# EasyEDA Pro project Drone.eprj, schematic Schematic1, sheets 5 to 9 of 9

## Sheets
5 Filitering Caps: Create Date: 2025-06-17; Page Name: Filitering Caps; Update Date: 2025-09-04
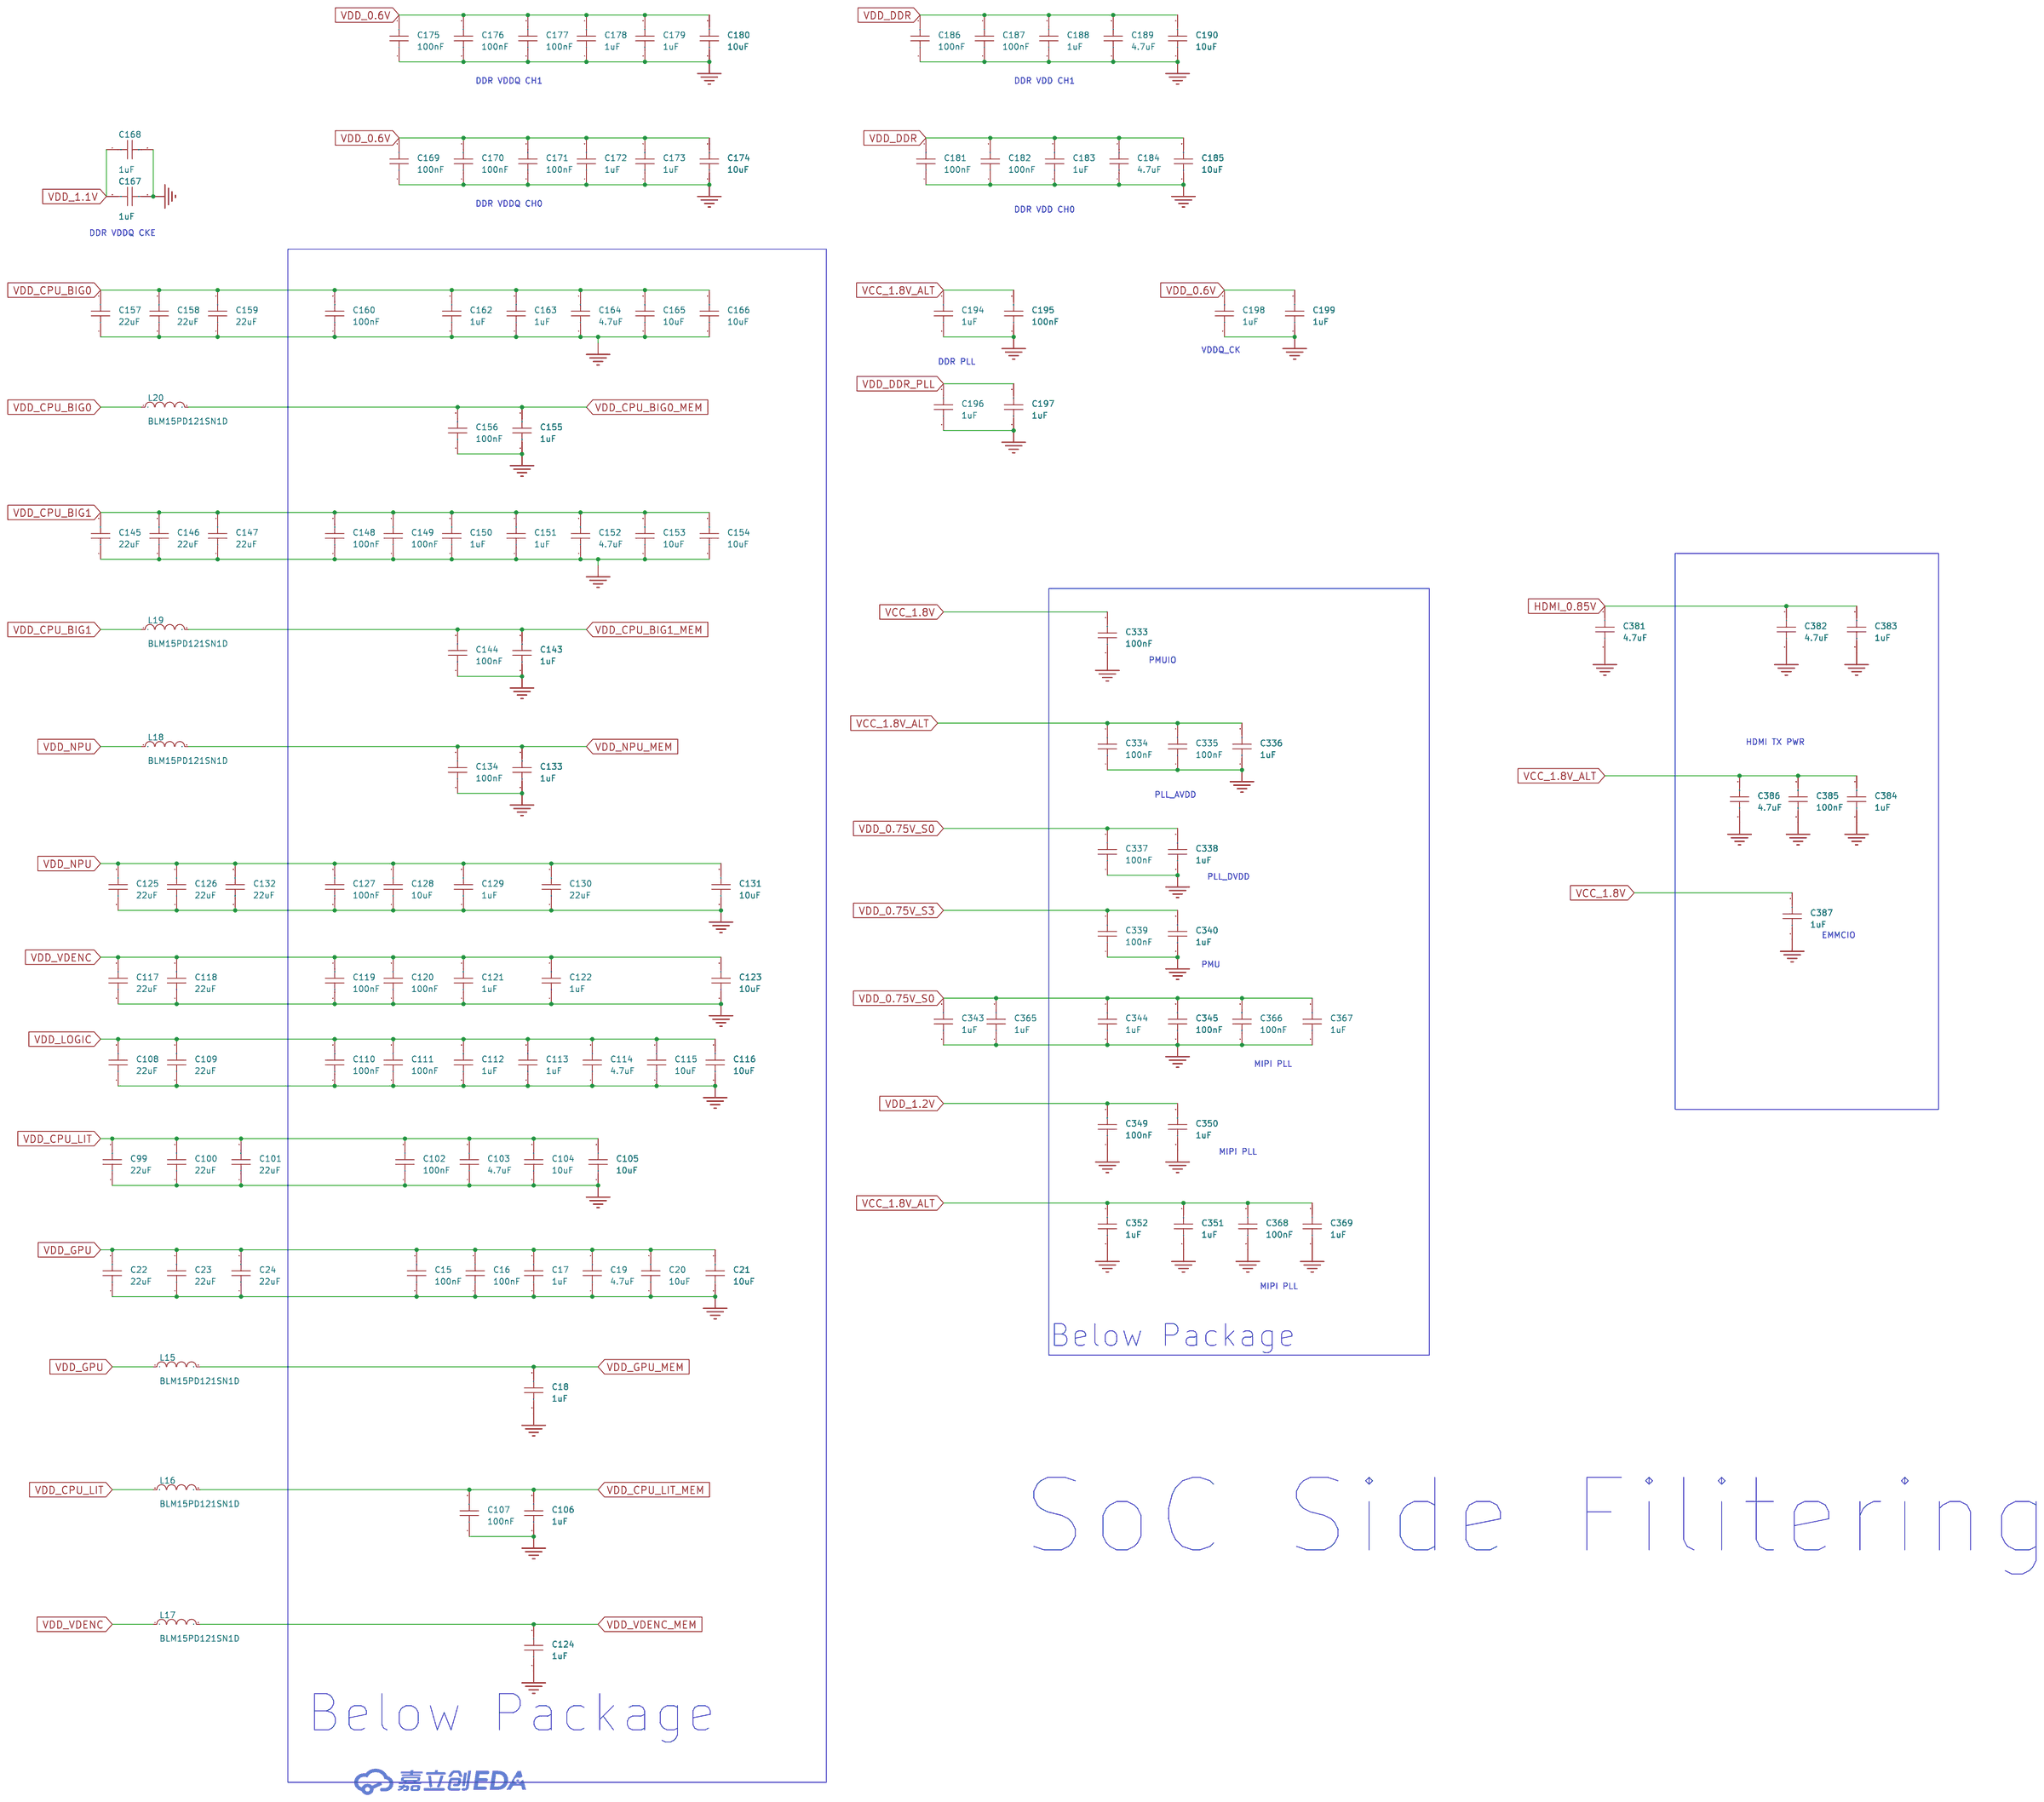
[diagram p4: Filitering Caps]
6 Wireless: Create Date: 2025-06-18; Page Name: Wireless; Update Date: 2025-08-09
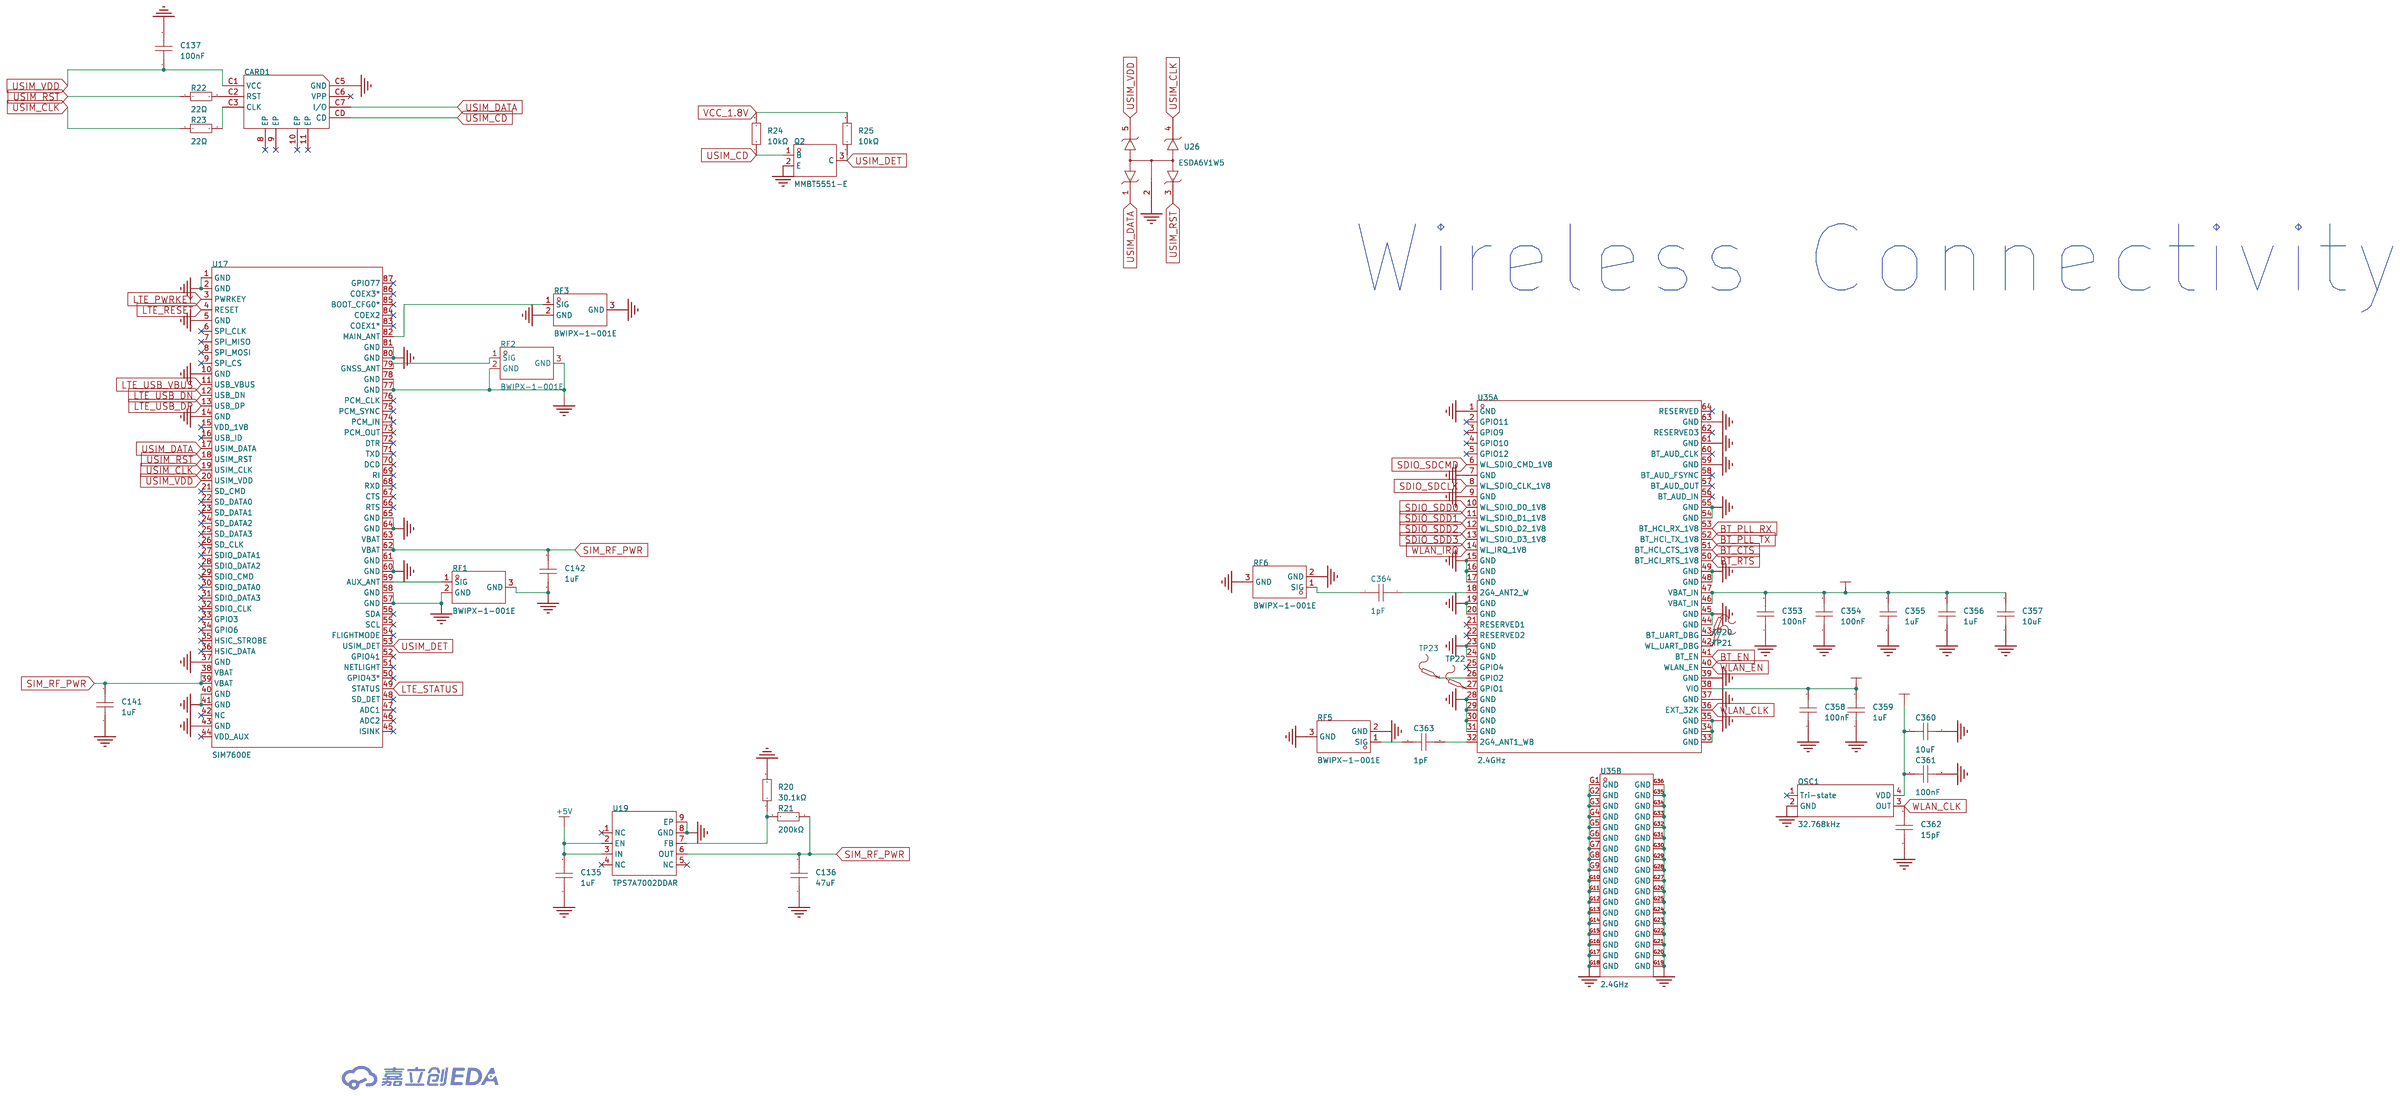
[diagram p5: Wireless]
7 Audio: Create Date: 2025-06-23; Page Name: P7; Update Date: 2025-06-30
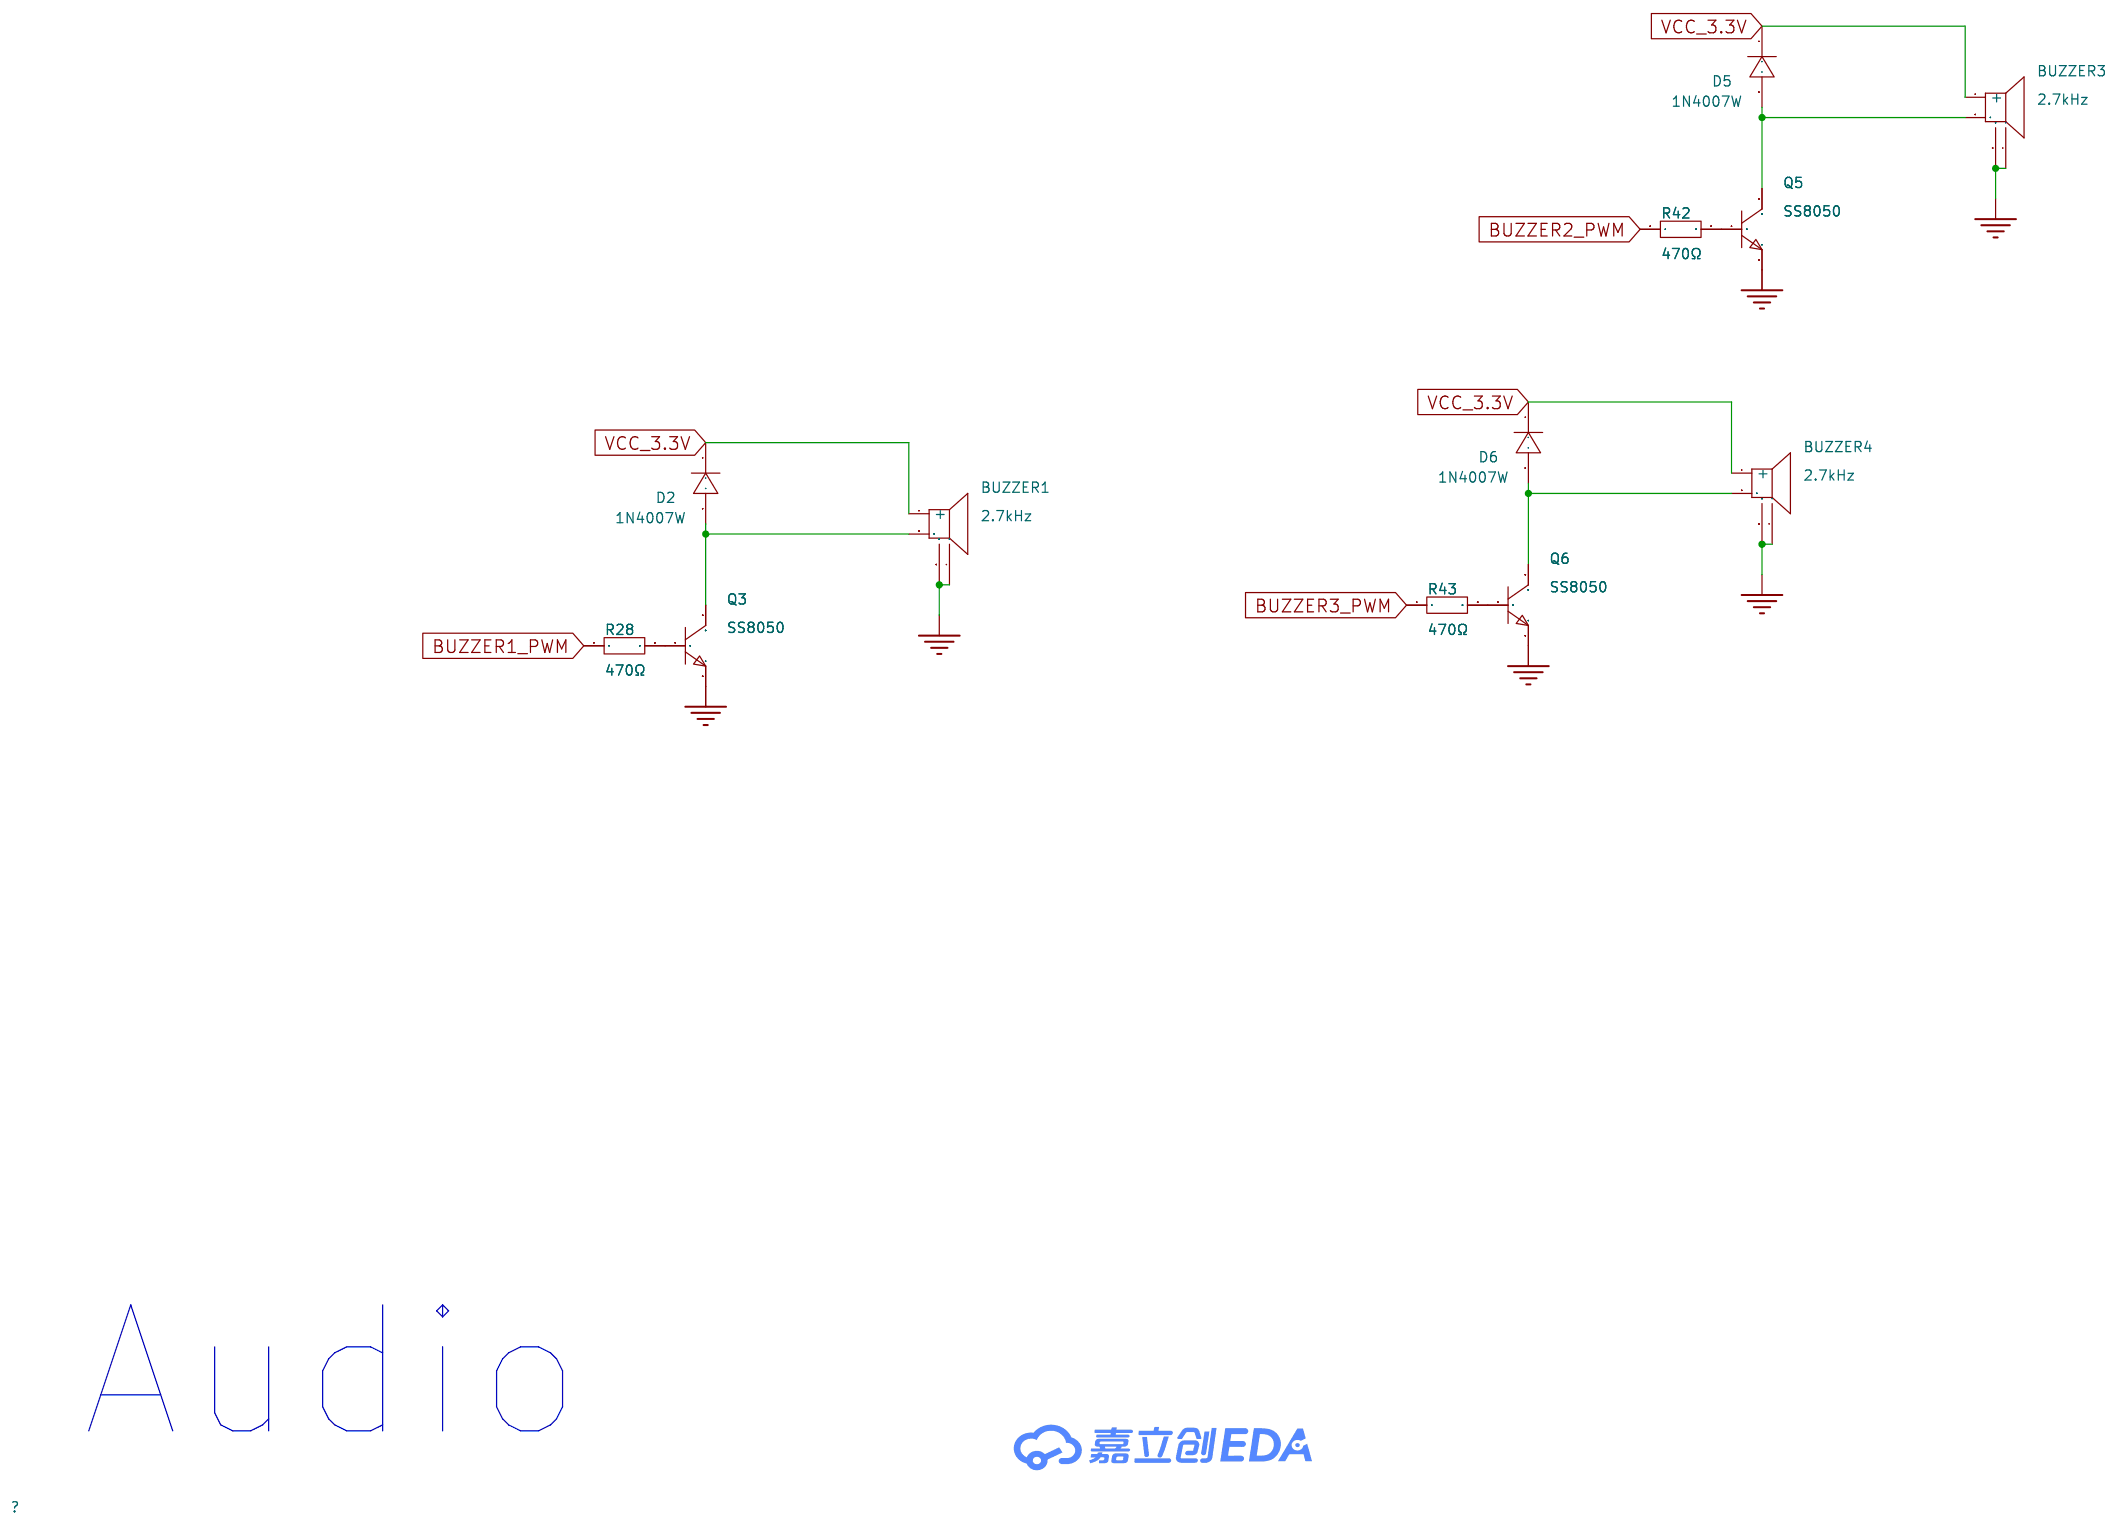
[diagram p6: Audio]
8 PLL Interface: Create Date: 2025-08-03; Page Name: PLL Interface; Update Date: 2025-08-07
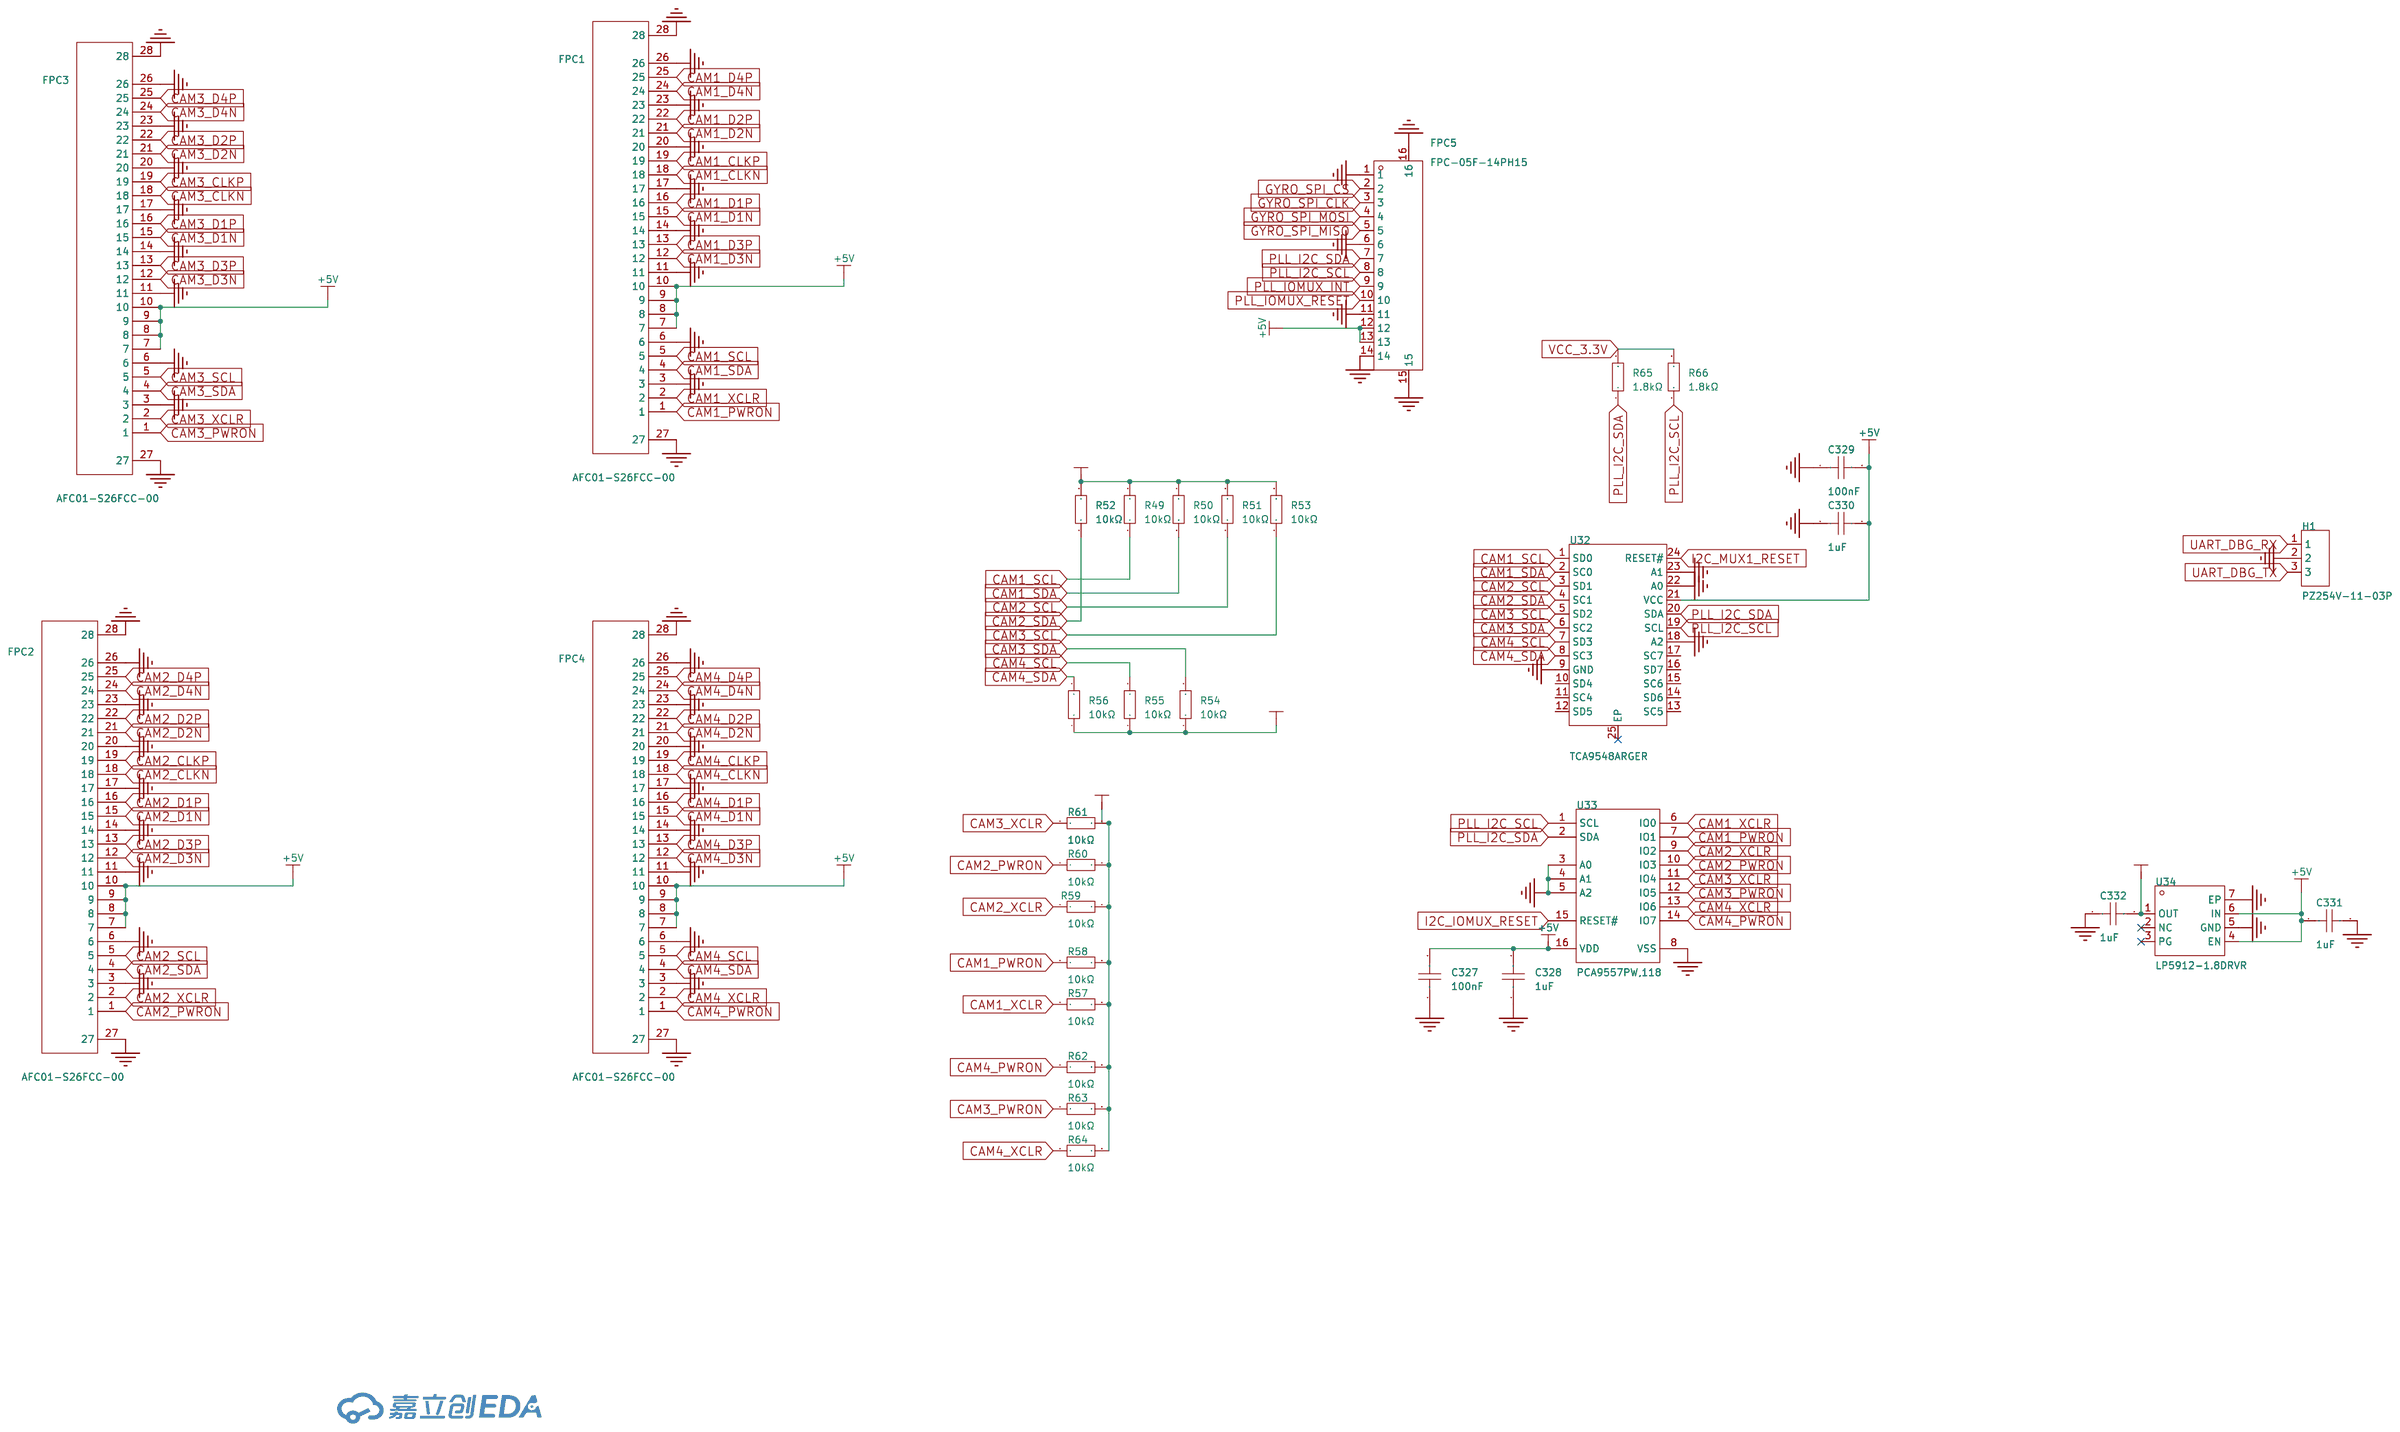
[diagram p7: PLL Interface]
9 HDMI and USB: Create Date: 2025-08-09; Page Name: HDMI and USB; Update Date: 2025-08-22
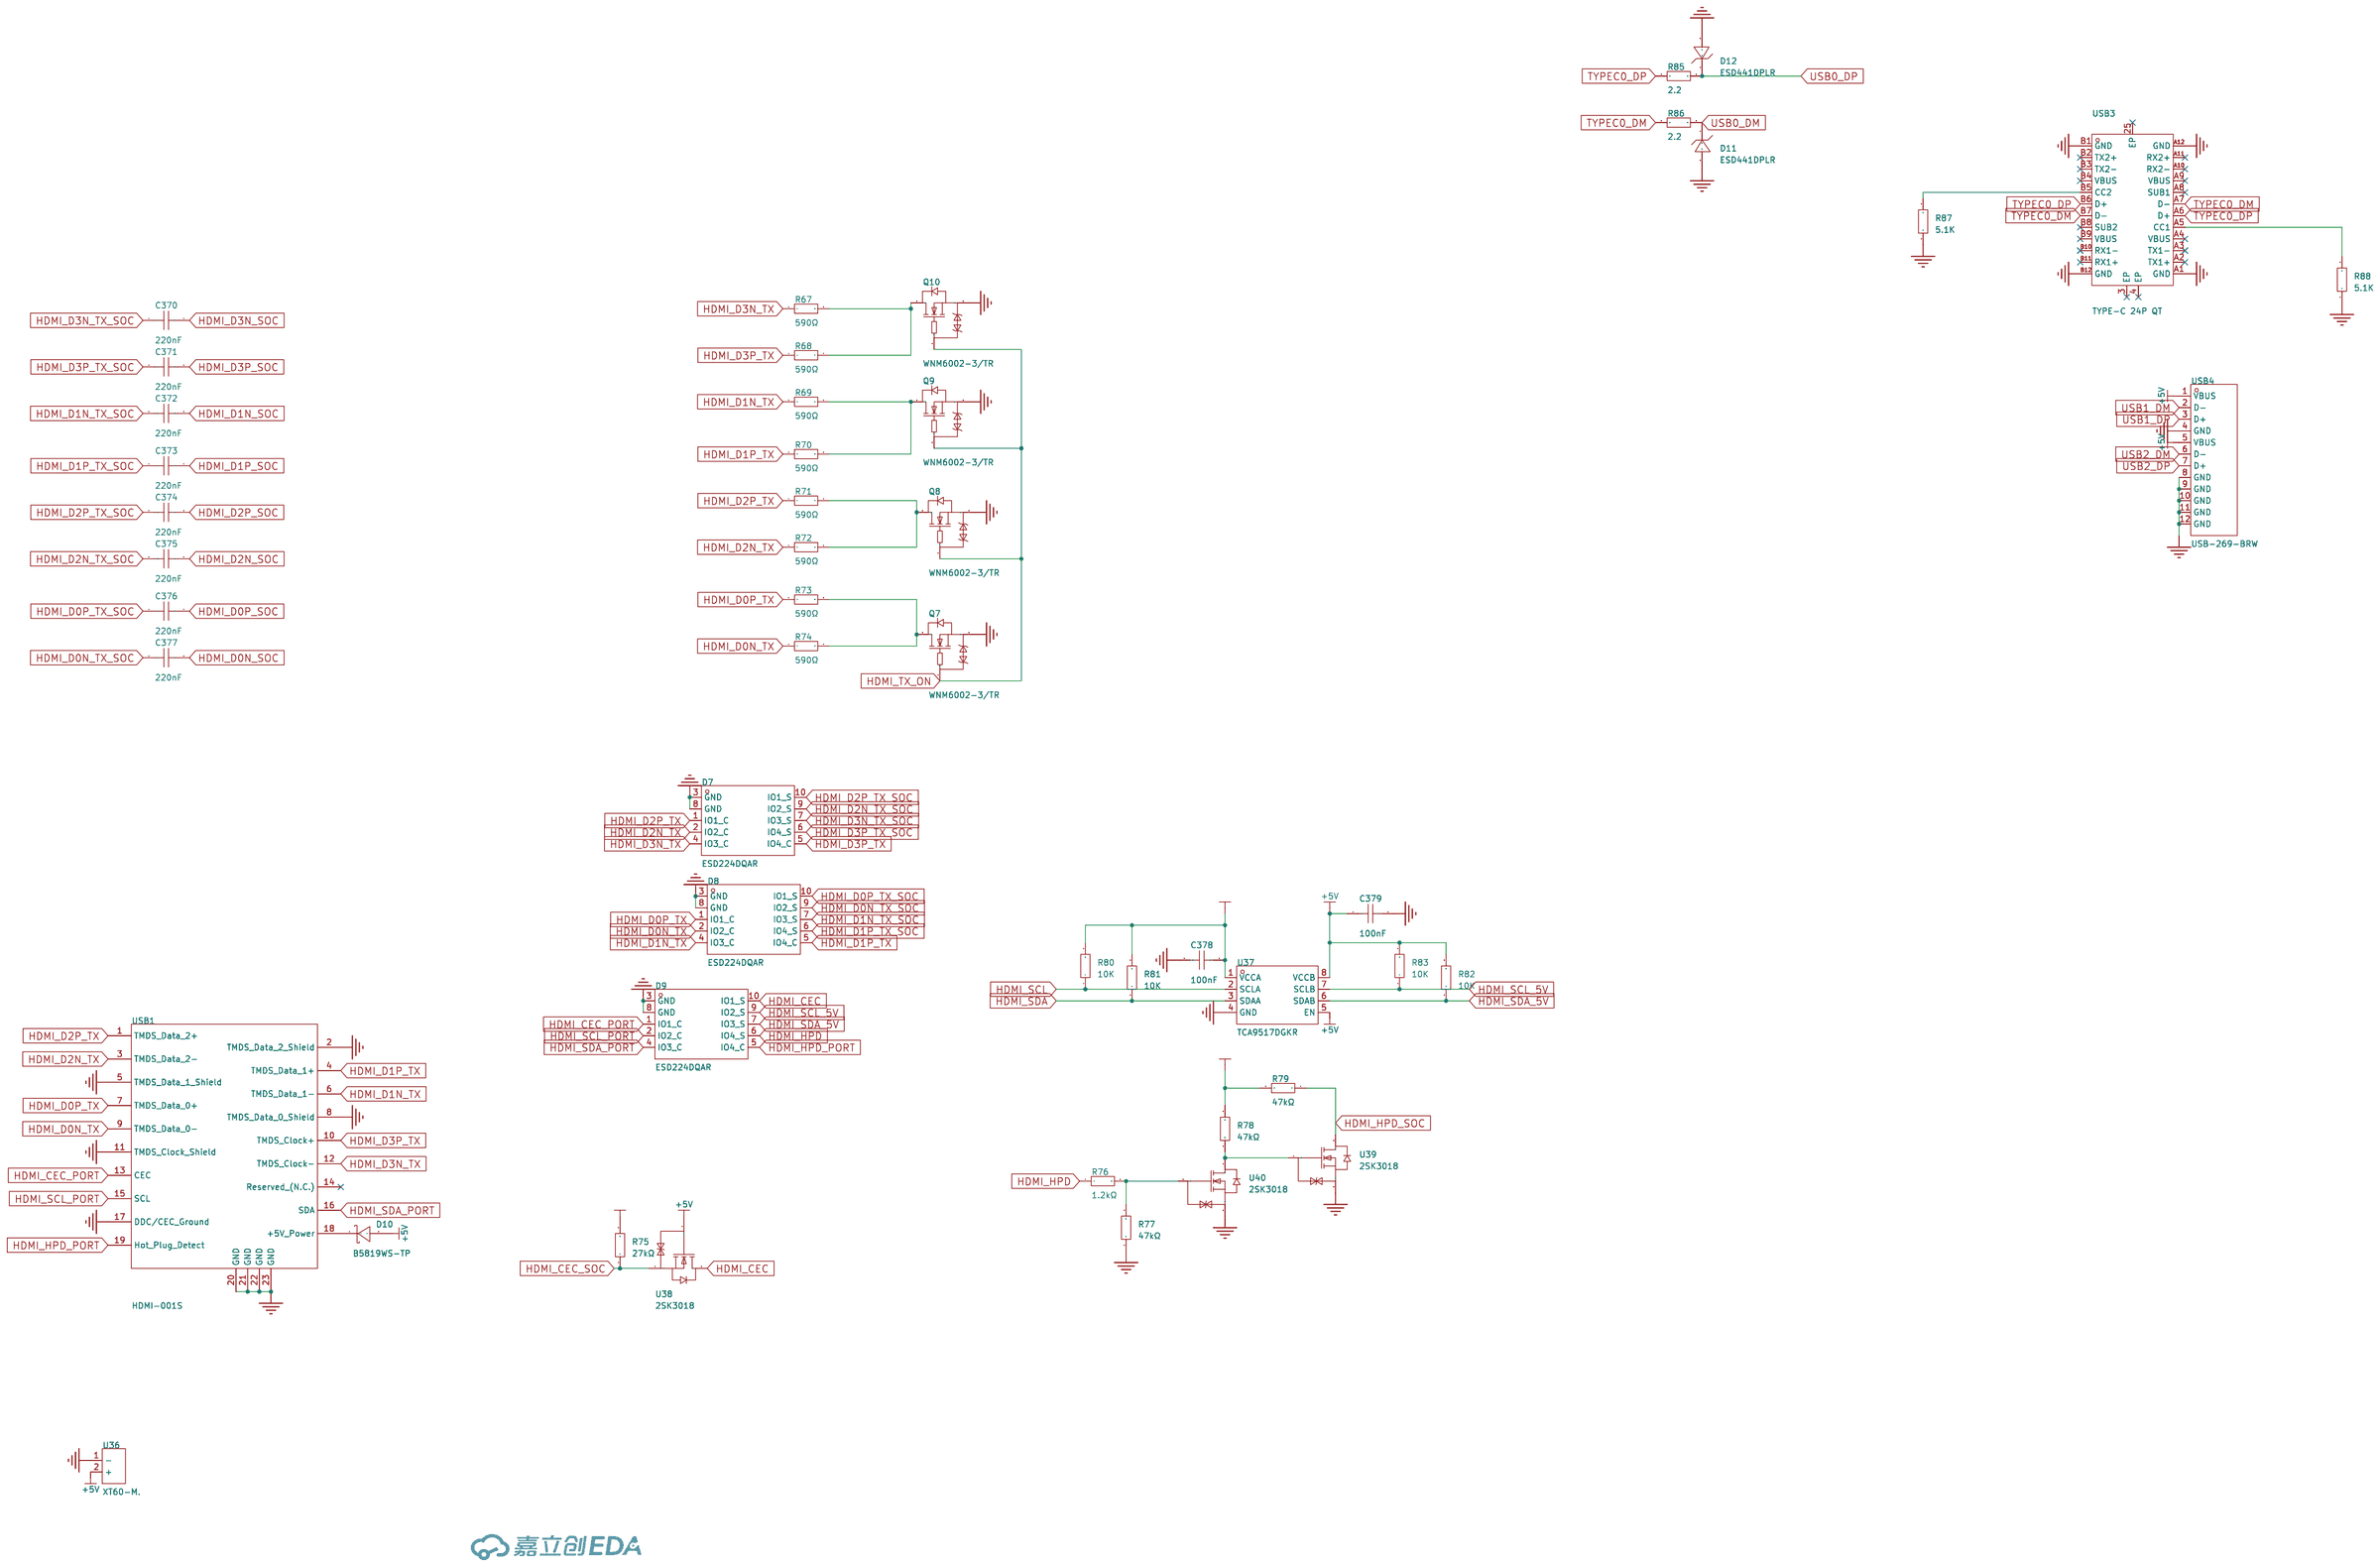
[diagram p8: HDMI and USB]

## Parts
sheet Audio
BUZZER1  2.7kHz  [BUZ-SMD_4P-L8.5-W8.5-P8.50-BR]
BUZZER3  2.7kHz  [BUZ-SMD_4P-L8.5-W8.5-P8.50-BR]
BUZZER4  2.7kHz  [BUZ-SMD_4P-L8.5-W8.5-P8.50-BR]
D2  1N4007W  [SOD-123FL_L2.7-W1.8-LS3.8-RD]
D5  1N4007W  [SOD-123FL_L2.7-W1.8-LS3.8-RD]
D6  1N4007W  [SOD-123FL_L2.7-W1.8-LS3.8-RD]
Q3  SS8050  [SOT-23-3_L2.9-W1.3-P1.90-LS2.4-BR]
Q5  SS8050  [SOT-23-3_L2.9-W1.3-P1.90-LS2.4-BR]
Q6  SS8050  [SOT-23-3_L2.9-W1.3-P1.90-LS2.4-BR]
R28  470Ω  [R0201]
R42  470Ω  [R0201]
R43  470Ω  [R0201]
sheet Filitering Caps
C15  100nF  [C01005]
C16  100nF  [C01005]
C17  1uF  [C0201]
C18  1uF  [C0201]
C19  4.7uF  [C0201]
C20  10uF  [C0402]
C21  10uF  [C0402]
C22  22uF  [C0402]
C23  22uF  [C0402]
C24  22uF  [C0402]
C99  22uF  [C0402]
C100  22uF  [C0402]
C101  22uF  [C0402]
C102  100nF  [C01005]
C103  4.7uF  [C0201]
C104  10uF  [C0402]
C105  10uF  [C0402]
C106  1uF  [C0201]
C107  100nF  [C01005]
C108  22uF  [C0402]
C109  22uF  [C0402]
C110  100nF  [C01005]
C111  100nF  [C01005]
C112  1uF  [C0201]
C113  1uF  [C0201]
C114  4.7uF  [C0201]
C115  10uF  [C0402]
C116  10uF  [C0402]
C117  22uF  [C0402]
C118  22uF  [C0402]
C119  100nF  [C01005]
C120  100nF  [C01005]
C121  1uF  [C0201]
C122  1uF  [C0201]
C123  10uF  [C0402]
C124  1uF  [C0201]
C125  22uF  [C0402]
C126  22uF  [C0402]
C127  100nF  [C01005]
C128  10uF  [C0402]
C129  1uF  [C0201]
C130  22uF  [C0402]
C131  10uF  [C0402]
C132  22uF  [C0402]
C133  1uF  [C0201]
C134  100nF  [C01005]
C143  1uF  [C0201]
C144  100nF  [C01005]
C145  22uF  [C0402]
C146  22uF  [C0402]
C147  22uF  [C0402]
C148  100nF  [C01005]
C149  100nF  [C01005]
C150  1uF  [C0201]
C151  1uF  [C0201]
C152  4.7uF  [C0201]
C153  10uF  [C0402]
C154  10uF  [C0402]
C155  1uF  [C0201]
C156  100nF  [C01005]
C157  22uF  [C0402]
C158  22uF  [C0402]
C159  22uF  [C0402]
C160  100nF  [C01005]
C162  1uF  [C0201]
C163  1uF  [C0201]
C164  4.7uF  [C0201]
C165  10uF  [C0402]
C166  10uF  [C0402]
C167  1uF  [C0201]
C168  1uF  [C0201]
C169  100nF  [C01005]
C170  100nF  [C01005]
C171  100nF  [C01005]
C172  1uF  [C0201]
C173  1uF  [C0201]
C174  10uF  [C0402]
C175  100nF  [C01005]
C176  100nF  [C01005]
C177  100nF  [C01005]
C178  1uF  [C0201]
C179  1uF  [C0201]
C180  10uF  [C0402]
C181  100nF  [C01005]
C182  100nF  [C01005]
C183  1uF  [C0201]
C184  4.7uF  [C0201]
C185  10uF  [C0402]
C186  100nF  [C01005]
C187  100nF  [C01005]
C188  1uF  [C0201]
C189  4.7uF  [C0201]
C190  10uF  [C0402]
C194  1uF  [C0201]
C195  100nF  [C01005]
C196  1uF  [C0201]
C197  1uF  [C0201]
C198  1uF  [C0201]
C199  1uF  [C0201]
C333  100nF  [C01005]
C334  100nF  [C01005]
C335  100nF  [C01005]
C336  1uF  [C0201]
C337  100nF  [C01005]
C338  1uF  [C0201]
C339  100nF  [C01005]
C340  1uF  [C0201]
C343  1uF  [C0201]
C344  1uF  [C0201]
C345  100nF  [C01005]
C349  100nF  [C01005]
C350  1uF  [C0201]
C351  1uF  [C0201]
C352  1uF  [C0201]
C365  1uF  [C0201]
C366  100nF  [C01005]
C367  1uF  [C0201]
C368  100nF  [C01005]
C369  1uF  [C0201]
C381  4.7uF  [C0201]
C382  4.7uF  [C0201]
C383  1uF  [C0201]
C384  1uF  [C0201]
C385  100nF  [C01005]
C386  4.7uF  [C0201]
C387  1uF  [C0603]
L15  BLM15PD121SN1D  [L0402]
L16  BLM15PD121SN1D  [L0402]
L17  BLM15PD121SN1D  [L0402]
L18  BLM15PD121SN1D  [L0402]
L19  BLM15PD121SN1D  [L0402]
L20  BLM15PD121SN1D  [L0402]
sheet HDMI and USB
C370  220nF  [C01005]
C371  220nF  [C01005]
C372  220nF  [C01005]
C373  220nF  [C01005]
C374  220nF  [C01005]
C375  220nF  [C01005]
C376  220nF  [C01005]
C377  220nF  [C01005]
C378  100nF  [C01005]
C379  100nF  [C01005]
D7  ESD224DQAR  [USON-10_L2.5-W1.0-P0.50-BL]
D8  ESD224DQAR  [USON-10_L2.5-W1.0-P0.50-BL]
D9  ESD224DQAR  [USON-10_L2.5-W1.0-P0.50-BL]
D10  B5819WS-TP  [SOD-323_L1.8-W1.3-LS2.5-RD]
D11  ESD441DPLR  [X2SON-2_L0.6-W0.3-P0.35]
D12  ESD441DPLR  [X2SON-2_L0.6-W0.3-P0.35]
Q7  WNM6002-3/TR  [SOT-323-3_L2.0-W1.3-P1.30-LS2.1-BR]
Q8  WNM6002-3/TR  [SOT-323-3_L2.0-W1.3-P1.30-LS2.1-BR]
Q9  WNM6002-3/TR  [SOT-323-3_L2.0-W1.3-P1.30-LS2.1-BR]
Q10  WNM6002-3/TR  [SOT-323-3_L2.0-W1.3-P1.30-LS2.1-BR]
R67  590Ω  [R0201]
R68  590Ω  [R0201]
R69  590Ω  [R0201]
R70  590Ω  [R0201]
R71  590Ω  [R0201]
R72  590Ω  [R0201]
R73  590Ω  [R0201]
R74  590Ω  [R0201]
R75  27kΩ  [R0201]
R76  1.2kΩ  [R0201]
R77  47kΩ  [R0201]
R78  47kΩ  [R0201]
R79  47kΩ  [R0201]
R80  10K  [R0603]
R81  10K  [R0603]
R82  10K  [R0603]
R83  10K  [R0603]
R85  2.2  [R0603]
R86  2.2  [R0603]
R87  5.1K  [R0603]
R88  5.1K  [R0603]
U36  XT60-M.  [CONN-TH_XT60]
U37  TCA9517DGKR  [VSSOP-8_L3.0-W3.0-P0.65-LS5.0-BL]
U38  2SK3018  [SOT-23-3_L2.9-W1.3-P0.95-LS2.4-BR]
U39  2SK3018  [SOT-23-3_L2.9-W1.3-P0.95-LS2.4-BR]
U40  2SK3018  [SOT-23-3_L2.9-W1.3-P0.95-LS2.4-BR]
USB1  HDMI-001S  [HDMI-SMD_HDMI-001S]
USB3  TYPE-C 24P QT  [USB-C-SMD_TYPE-C-24P-QT]
USB4  USB-269-BRW  [USB-A-TH_USB-269-BRW]
sheet PLL Interface
C327  100nF  [C01005]
C328  1uF  [C0201]
C329  100nF  [C01005]
C330  1uF  [C0201]
C331  1uF  [C0201]
C332  1uF  [C0201]
FPC1  AFC01-S26FCC-00  [FPC-SMD_AFC01-S26FCC-00]
FPC2  AFC01-S26FCC-00  [FPC-SMD_AFC01-S26FCC-00]
FPC3  AFC01-S26FCC-00  [FPC-SMD_AFC01-S26FCC-00]
FPC4  AFC01-S26FCC-00  [FPC-SMD_AFC01-S26FCC-00]
FPC5  FPC-05F-14PH15  [FPC-SMD_14P-P0.50_XUNPU_FPC-05F-14PH15]
H1  PZ254V-11-03P  [HDR-TH_3P-P2.54-V-M]
R49  10kΩ  [R01005]
R50  10kΩ  [R01005]
R51  10kΩ  [R01005]
R52  10kΩ  [R01005]
R53  10kΩ  [R01005]
R54  10kΩ  [R01005]
R55  10kΩ  [R01005]
R56  10kΩ  [R01005]
R57  10kΩ  [R01005]
R58  10kΩ  [R01005]
R59  10kΩ  [R01005]
R60  10kΩ  [R01005]
R61  10kΩ  [R01005]
R62  10kΩ  [R01005]
R63  10kΩ  [R01005]
R64  10kΩ  [R01005]
R65  1.8kΩ  [R01005]
R66  1.8kΩ  [R01005]
U32  TCA9548ARGER  [VQFN-24_L4.0-W4.0-P0.50-BL-EP2.5]
U33  PCA9557PW,118  [TSSOP-16_L5.0-W4.4-P0.65-LS6.4-BL]
U34  LP5912-1.8DRVR  [WSON-6_L2.0-W2.0-P0.65-TL-EP]
sheet Wireless
C135  1uF  [C0201]
C136  47uF  [C0603]
C137  100nF  [C01005]
C141  1uF  [C0201]
C142  1uF  [C0201]
C353  100nF  [C01005]
C354  100nF  [C01005]
C355  1uF  [C0201]
C356  1uF  [C0201]
C357  10uF  [C0402]
C358  100nF  [C01005]
C359  1uF  [C0201]
C360  10uF  [C0402]
C361  100nF  [C01005]
C362  15pF  [C01005]
C363  1pF  [C0201]
C364  1pF  [C0201]
CARD1  SMN-303  [SIM-SMD_SMN-303]
OSC1  32.768kHz  [OSC-SMD_4P-L3.2-W2.5-BL_TG-5006CE]
Q2  MMBT5551-E  [SOT-23-3_L2.9-W1.8-P1.90-LS2.4-BR]
R20  30.1kΩ  [R0201]
R21  200kΩ  [R0201]
R22  22Ω  [R0201]
R23  22Ω  [R0201]
R24  10kΩ  [R0201]
R25  10kΩ  [R0201]
RF1  BWIPX-1-001E  [IPEX-SMD_BWIPX-1-001E]
RF2  BWIPX-1-001E  [IPEX-SMD_BWIPX-1-001E]
RF3  BWIPX-1-001E  [IPEX-SMD_BWIPX-1-001E]
RF5  BWIPX-1-001E  [IPEX-SMD_BWIPX-1-001E]
RF6  BWIPX-1-001E  [IPEX-SMD_BWIPX-1-001E]
TP20  -  [Test-Point-0.5mm]
TP21  -  [Test-Point-0.5mm]
TP22  -  [Test-Point-0.5mm]
TP23  -  [Test-Point-0.5mm]
U17  SIM7600E  [COMM-SMD_L30.0-W30.0_SIM7600E]
U19  TPS7A7002DDAR  [SOIC-8_L4.9-W3.9-P1.27-LS6.0-BL-EP]
U26  ESDA6V1W5  [SC-70-5_L2.1-W1.3-P0.65-LS2.1-BR]
U35  2.4GHz  [WIRELM-SMD_TI_WL18X]  (sections 1,2)

## Library data of the parts
BUZZER1 BUZZER3 BUZZER4 = MLT-8530_C94599: LCSC Part Name: MLT-8530; Supplier Part: C94599; Manufacturer: 华能; Manufacturer Part: MLT-8530; Supplier Footprint: SMD,8.5x8.5mm; JLCPCB Part Class: 扩展库; Datasheet: https://atta.szlcsc.com/upload/public/pdf/source/20170522/1495448322339.pdf; Supplier: LCSC; Driver Circuitry: 无源(外部驱动); Technology: 电磁式; Voltage - Supply: 2.5V~4.5V; Sound Pressure Level(SPL): 80dB; Length: 8.5mm; Width: 8.5mm; Height: 3.3mm
D2 D5 D6 = 1N4007W_C18199088: Supplier Part: C18199088; Manufacturer: 宏迦橙; Supplier Footprint: SOD-123FL; JLCPCB Part Class: 扩展库; Datasheet: https://atta.szlcsc.com/upload/public/pdf/source/20230925/B0AB2B510D392D7083D021E804ED238F.pdf; Supplier: LCSC; Diode Configuration: 独立式; Forward Voltage (Vf@If): 1V@1.0A; Reverse Voltage (Vr): 1kV; Rectified Current: 1A; Reverse Leakage Current (Ir): 2uA@1000V
Q3 Q5 Q6 = SS8050_C7420370: LCSC Part Name: H档 200-350; Supplier Part: C7420370; Manufacturer: 宏嘉诚; Supplier Footprint: SOT-23; JLCPCB Part Class: 扩展库; Datasheet: https://atta.szlcsc.com/upload/public/pdf/source/20250205/5DB94E86981B5B1A1866D18E379C0D4F.pdf; Supplier: LCSC; type: NPN; Current - Collector(Ic): 1.5A; Collector - Emitter Voltage VCEO: 25V; Pd - Power Dissipation: 300mW; DC Current Gain: 120@100mA,1.0V; Transition frequency(fT): 100MHz; Current - Collector Cutoff: 100nA; Vce Saturation(VCE(sat)): 500mV; Operating Temperature: -55℃~+150℃
R28 R42 R43 = 0201WMF4700TEE: LCSC Part Name: 470Ω ±1% 50mW 厚膜电阻; Supplier Part: C473464; Manufacturer: UNI-ROYAL(厚声); Supplier Footprint: 0201; JLCPCB Part Class: Extended Part; Datasheet: https://atta.szlcsc.com/upload/public/pdf/source/20200306/C422600_1E6D84923E4A46A82E41ADD87F860B5C.pdf; Supplier: LCSC; Type: 厚膜电阻; Tolerance: ±1%; Power(Watts): 50mW; Overload Voltage (Max): 25V; Temperature Coefficient: ±200ppm/℃; Operating Temperature Range: -55℃~+155℃
C15 C16 C102 C107 C110 C111 C119 C120 C127 C134 C137 C144 C148 C149 C156 C160 C169-C171 C175-C177 C181 C182 C186 C187 C195 = GRM022R61A104KE01L: LCSC Part Name: 100nF ±10% 10V; Supplier Part: C3902316; Manufacturer: muRata(村田); Supplier Footprint: 01005; JLCPCB Part Class: Extended Part; Datasheet: https://atta.szlcsc.com/upload/public/pdf/source/20230811/D83B5EC37FE7C54F2244C4076719DD2E.pdf; Supplier: LCSC; Tolerance: ±10%; Voltage Rated: 10V; Temperature Coefficient: X5R
C17 C18 C106 C124 C133 C143 C155 = HGC0201R5105K100NTCJ: LCSC Part Name: 1uF ±10% 10V; Supplier Part: C7432760; Manufacturer: Chinocera(华瓷); Supplier Footprint: 0201; JLCPCB Part Class: Extended Part; Datasheet: https://atta.szlcsc.com/upload/public/pdf/source/20240320/FAC3FEC40A78BC5CCCE96C232A94D860.pdf; Supplier: LCSC; Tolerance: ±10%; Voltage Rated: 10V; Temperature Coefficient: X5R
C19 C103 C114 C152 C164 C184 C189 = GRM035R60J475ME15D: LCSC Part Name: 4.7uF ±20% 6.3V; Supplier Part: C335103; Manufacturer: muRata(村田); Supplier Footprint: 0201; JLCPCB Part Class: Extended Part; Datasheet: https://atta.szlcsc.com/upload/public/pdf/source/20200305/C490387_23319AE8C154DEB24C505E6C82A8106A.pdf; Supplier: LCSC; Tolerance: ±20%; Voltage Rating: 6.3V; Temperature Coefficient: X5R
C20 C21 C104 C105 C115 C116 C123 C128 C131 C153 C154 C165 C166 = HGC0402R5106M100NTEJ: LCSC Part Name: 10uF ±20% 10V; Supplier Part: C7472949; Manufacturer: Chinocera(华瓷); Supplier Footprint: 0402; JLCPCB Part Class: Extended Part; Datasheet: https://atta.szlcsc.com/upload/public/pdf/source/20240320/FAC3FEC40A78BC5CCCE96C232A94D860.pdf; Supplier: LCSC; Tolerance: ±20%; Voltage Rated: 10V; Temperature Coefficient: X5R
C22-C24 C99-C101 C108 C109 C117 C118 C125 C126 C130 C132 C145-C147 C157-C159 = GRM155R60J226ME11D: LCSC Part Name: 22uF ±20% 6.3V; Supplier Part: C415703; Manufacturer: muRata(村田); Supplier Footprint: 0402; JLCPCB Part Class: Extended Part; Datasheet: https://atta.szlcsc.com/upload/public/pdf/source/20200305/C490387_23319AE8C154DEB24C505E6C82A8106A.pdf; Supplier: LCSC; Tolerance: ±20%; Voltage Rating: 6.3V; Temperature Coefficient: X5R
C112 C113 C121 C122 C129 C135 C141 C142 C150 C151 C162 C163 = CGA0201X5R105M6R3ET: LCSC Part Name: 1uF ±20% 6.3V; Supplier Part: C6119749; Manufacturer: HRE(芯声); Supplier Footprint: 0201; JLCPCB Part Class: Extended Part; Supplier: LCSC; Tolerance: ±20%; Voltage Rating: 6.3V; Temperature Coefficient: X5R
C167 C168 C172 C173 C178 C179 C183 C188 C194 C196-C199 C328 C330-C332 C336 C338 C340 C343 C344 C350-C352 C355 C356 C359 C365 C367 C369 C383 C384 = GRM033R61A105ME44D: LCSC Part Name: 1uF ±20% 10V; Supplier Part: C76935; Manufacturer: muRata(村田); Supplier Footprint: 0201; JLCPCB Part Class: Extended Part; Datasheet: https://atta.szlcsc.com/upload/public/pdf/source/20190904/C426118_85E81C7C1F21FC87C5FB6D536E0847B4.pdf; Supplier: LCSC; Tolerance: ±20%; Voltage Rated: 10V; Temperature Coefficient: X5R
C174 C180 C185 C190 C357 C360 = CL05A106MP5NUNC: LCSC Part Name: 10uF ±20% 10V; Supplier Part: C315248; Manufacturer: SAMSUNG(三星); Supplier Footprint: 0402; JLCPCB Part Class: Extended Part; Datasheet: https://atta.szlcsc.com/upload/public/pdf/source/20231220/1EF805BAE1520675928CC4638D279E74.pdf; Supplier: LCSC; Tolerance: ±20%; Voltage Rated: 10V; Temperature Coefficient: X5R
C327 C329 C333-C335 C337 C339 C345 C349 C353 C354 C358 C361 C366 C368 C378 C379 C385 = GRM022R60J104KE15D: LCSC Part Name: 100nF ±10% 6.3V; Supplier Part: C161362; Manufacturer: muRata(村田); Supplier Footprint: 01005; JLCPCB Part Class: Extended Part; Datasheet: https://atta.szlcsc.com/upload/public/pdf/source/20200305/C490387_23319AE8C154DEB24C505E6C82A8106A.pdf; Supplier: LCSC; Tolerance: ±10%; Voltage Rating: 6.3V; Temperature Coefficient: X5R
C381 C382 C386 = GRM035R60J475ME15D: LCSC Part Name: 4.7uF ±20% 6.3V; Supplier Part: C335103; Manufacturer: muRata(村田); Supplier Footprint: 0201; JLCPCB Part Class: Extended Part; Datasheet: https://item.szlcsc.com/datasheet/GRM035R60J475ME15D/313624.html; Supplier: LCSC; Tolerance: ±20%; Voltage Rating: 6.3V; Temperature Coefficient: X5R
C387 = CAP_0603: Supplier Footprint: 0603
L15-L20 = BLM15PD121SN1D: LCSC Part Name: 单路 0402磁珠 阻抗120Ω@100MHz; Supplier Part: C76891; Manufacturer: muRata(村田); Supplier Footprint: 0402; JLCPCB Part Class: 扩展库; Datasheet: https://atta.szlcsc.com/upload/public/pdf/source/20181120/C333978_3E581FB55966932B05020139ABDE8E01.pdf; Supplier: LCSC; Impedance @ Frequency: 120Ω@100MHz; Tolerance: ±25%; DC Resistance: 90mΩ; Current Rating: 1.3A; Circuits: 1
C370-C377 = GRM022R60J224KE14D: LCSC Part Name: 220nF ±10% 6.3V; Supplier Part: C883592; Manufacturer: muRata(村田); Supplier Footprint: 01005; JLCPCB Part Class: Extended Part; Datasheet: https://atta.szlcsc.com/upload/public/pdf/source/20201027/C883551_458405A74FCB13773427E37ABAEDB4CB.pdf; Supplier: LCSC; Tolerance: ±10%; Voltage Rating: 6.3V
D7-D9 = ESD224DQAR: Supplier Part: C1981316; Manufacturer: TI(德州仪器); Supplier Footprint: USON-10(1x2.5); JLCPCB Part Class: 扩展库; Datasheet: https://www.ti.com/cn/lit/gpn/esd224; Supplier: LCSC; Reverse Stand-Off Voltage (Vrwm): 3.6V; Maximum Clamping Voltage: 14V; Peak Pulse Current (Ipp)@10/1000us: 2A@(8/20us); Peak Pulse Power Dissipation (Ppp)@10/1000us: 17W; Breakdown Voltage: 7.9V; Operating Temperature: -40℃~+125℃@(Ta); Type: ESD
D10 = B5819WS-TP: LCSC Part Name: 电压:40V 电流:1A; Supplier Part: C78734; Manufacturer: MCC(美微科); Supplier Footprint: SOD-323; JLCPCB Part Class: 扩展库; Datasheet: https://atta.szlcsc.com/upload/public/pdf/source/20190308/C78734_7BD7F562D63F05C7B4187010ADA330AA.pdf; Supplier: LCSC; Forward Voltage (Vf@If): 600mV@1A; Reverse Voltage (Vr): 40V; Average Rectified Current (Io): 1A; Reverse Leakage Current (Ir): 1mA@40V
D11 D12 = ESD441DPLR: LCSC Part Name: 单向ESD 5.5V截止 峰值浪涌电流：6.2A@8/20us; Supplier Part: C22427765; Manufacturer: TI(德州仪器); Supplier Footprint: X2SON-2(0.3x0.6); JLCPCB Part Class: 扩展库; Datasheet: https://www.ti.com.cn/cn/lit/ds/symlink/esd441.pdf?ts=1739430943704&ref_url=https%253A%252F%252Fwww.ti.com.cn%252Fsitesearch%252Fzh-cn%252Fdocs%252Funiversalsearch.tsp%253FlangPref%253Dzh-CN%2526nr%253D12%2526searchTerm%253DESD441DPLR; Supplier: LCSC; Polarity: 单向; Reverse Stand-Off Voltage (Vrwm): 5.5V; Clamping Voltage: 7.6V; Peak Pulse Current (Ipp): 6.2A@8/20us; Voltage - Breakdown: 7V; Reverse Leakage Current (Ir): 50nA; Number of Channels: 单路; Operating Temperature: -55℃~+150℃; level of protection: IEC 61000-4-5；IEC 61000-4-2; Type: ESD; Junction Capacitance: 1pF
Q7-Q10 = WNM6002-3/TR: LCSC Part Name: 1个N沟道 耐压:60V 电流:300mA; Supplier Part: C501342; Manufacturer: WILLSEMI(韦尔); Supplier Footprint: SOT-323-3; JLCPCB Part Class: 扩展库; Datasheet: https://atta.szlcsc.com/upload/public/pdf/source/20200324/C501342_29E9D9C6E1199381F55B20D6C6C9F64A.pdf; Supplier: LCSC; Type: 1个N沟道; Drain to Source Voltage: 60V; Current - Continuous Drain(Id): 300mA; RDS(on): 1.7Ω@4.5V,0.2A; Gate Threshold Voltage (Vgs(th)@Id): 800mV; Gate Charge(Qg): 1.2nC@10V; Input Capacitance(Ciss@Vds): 23.37pF; Reverse Transfer Capacitance (Crss@Vds): 5.2pF@25V; Operating Temperature: -55℃~+150℃
R67-R74 = 0201WMF5900TEE: LCSC Part Name: 590Ω ±1% 50mW 厚膜电阻; Supplier Part: C474302; Manufacturer: UNI-ROYAL(厚声); Supplier Footprint: 0201; JLCPCB Part Class: Extended Part; Datasheet: https://atta.szlcsc.com/upload/public/pdf/source/20200306/C422600_1E6D84923E4A46A82E41ADD87F860B5C.pdf; Supplier: LCSC; Type: 厚膜电阻; Tolerance: ±1%; Power(Watts): 50mW; Overload Voltage (Max): 25V; Temperature Coefficient: ±200ppm/℃; Operating Temperature Range: -55℃~+155℃
R75 = 0201WMF2702TEE: LCSC Part Name: 27kΩ ±1% 50mW 厚膜电阻; Supplier Part: C270351; Manufacturer: UNI-ROYAL(厚声); Supplier Footprint: 0201; JLCPCB Part Class: Extended Part; Datasheet: https://item.szlcsc.com/datasheet/0201WMF2702TEE/259881.html; Supplier: LCSC; Type: 厚膜电阻; Tolerance: ±1%; Power(Watts): 50mW; Voltage-Supply(Max): 25V; Temperature Coefficient: ±200ppm/℃; Operating Temperature: -55℃~+155℃
R76 = 0201WMJ0122TEE: LCSC Part Name: 1.2kΩ ±5% 50mW 厚膜电阻; Supplier Part: C473441; Manufacturer: UNI-ROYAL(厚声); Supplier Footprint: 0201; JLCPCB Part Class: Extended Part; Datasheet: https://atta.szlcsc.com/upload/public/pdf/source/20200306/C422600_1E6D84923E4A46A82E41ADD87F860B5C.pdf; Supplier: LCSC; Type: 厚膜电阻; Tolerance: ±5%; Power(Watts): 50mW; Overload Voltage (Max): 25V; Temperature Coefficient: ±200ppm/℃; Operating Temperature Range: -55℃~+155℃
R77-R79 = RC0201FR-0747KL: LCSC Part Name: 厚膜电阻 47kΩ ±1% 50mW; Supplier Part: C138139; Manufacturer: YAGEO(国巨); Supplier Footprint: 0201; JLCPCB Part Class: Extended Part; Datasheet: https://atta.szlcsc.com/upload/public/pdf/source/20181009/C309620_DA5935B6E1D48212CB7A533FE518B3C2.pdf; Supplier: LCSC; Type: 厚膜电阻; Tolerance: ±1%; Power(Watts): 50mW; Overload Voltage (Max): 25V; Temperature Coefficient: ±200ppm/℃; Operating Temperature Range: -55℃~+125℃
R80-R83 R85-R88 = Res_0603: Supplier Footprint: 0603
U36 = XT60-M.: LCSC Part Name: AMASS(艾迈斯) XT60模型插头 3.5mm镀金香蕉头公头（电调端）XT60-M; Supplier Part: C98733; Manufacturer: AMASS(艾迈斯); JLCPCB Part Class: 扩展库; Datasheet: https://item.szlcsc.com/datasheet/XT60-M./99943.html; Supplier: LCSC; Type: 香蕉头; Colour: 黄色; InterfaceType: 公头; specifications: 3.5mm
U37 = TCA9517DGKR: LCSC Part Name: 2位双向电平转换器; Supplier Part: C544515; Manufacturer: TI(德州仪器); Supplier Footprint: VSSOP-8-0.65mm; JLCPCB Part Class: 扩展库; Datasheet: https://www.ti.com/cn/lit/gpn/tca9517; Supplier: LCSC; Channel Type: 双向; Voltage - Supply(VCCA): 900mV~5.5V; Voltage - Supply(VCCB): 2.7V~5.5V; Number of Circuits: 2; Output Type: 开漏; Operating Temperature: -40℃~+85℃
U38-U40 = 2SK3018_C20069148: LCSC Part Name: 1个N沟道 耐压:30V 电流:100mA; Supplier Part: C20069148; Manufacturer: 宏嘉诚; Supplier Footprint: SOT-23; JLCPCB Part Class: 扩展库; Datasheet: https://item.szlcsc.com/datasheet/2SK3018/21397186.html; Supplier: LCSC; Number: 1个N沟道; Drain to Source Voltage: 30V; Current - Continuous Drain(Id): 100mA; RDS(on): 8Ω@4.0V；13Ω@2.5V; Pd - Power Dissipation: 200mW; Gate Threshold Voltage (Vgs(th)): 1.5V@0.1mA; Input Capacitance(Ciss): 13pF; Reverse Transfer Capacitance (Crss@Vds): 4pF; Operating Temperature: -55℃~+150℃; Type: N沟道; Output Capacitance(Coss): 9pF
USB1 = HDMI-001S: Supplier Part: C720616; Manufacturer: XUNPU(讯普); Supplier Footprint: SMD; JLCPCB Part Class: 扩展库; Datasheet: https://atta.szlcsc.com/upload/public/pdf/source/20230810/ECFF1CC9EF38DC7E290ED6B9AC4EFC06.pdf; Supplier: LCSC; Connector Type: HDMI-A; Gender: 母; Number of Pins: 19P; Mounting Style: 卧贴
USB3 = TYPE-C 24P QT: LCSC Part Name: Type-C 母 卧贴; Supplier Part: C2681555; Manufacturer: SHOU HAN(首韩); Supplier Footprint: SMD; JLCPCB Part Class: 扩展库; Datasheet: https://atta.szlcsc.com/upload/public/pdf/source/20210122/C2681555_B75587FEA5DEA09BB26723DEE30F6A05.pdf; Supplier: LCSC; Connector Type: Type-C; Standard: USB 3.1; Gender: 母; Mounting Style: 卧贴; Number of Contacts: 24P; Number of Ports: 1; Current Rating - Power (Max): 3A; Operating Temperature Range: -30℃~+80℃; Connect-Disconnect Life: 1万次; Core Colour: 黑色
USB4 = USB-269-BRW: LCSC Part Name: Type-A 母 弯插; Supplier Part: C720548; Manufacturer: XUNPU(讯普); Supplier Footprint: 插件; JLCPCB Part Class: 扩展库; Datasheet: https://atta.szlcsc.com/upload/public/pdf/source/20230927/4A1ED24CE587C5B05C94D6B8B1039B50.pdf; Supplier: LCSC; Connector Type: Type-A; Standard: USB 2.0; Gender: 母; Mounting Style: 弯插; Number of Contacts: 4Px2; Number of Ports: 2; Current Rating - Power (Max): 1.5A; Operating Temperature Range: -20℃~+70℃
FPC1-FPC4 = AFC01-S26FCC-00: 锁定特性:翻盖式;触点类型:下接;触点数量:26P;间距:0.5mm;安装类型:卧贴;; LCSC Part Name: 间距:0.5mm P数:26P 翻盖式 下接; Supplier Part: C262277; Manufacturer: JS(钜硕电子); Supplier Footprint: SMD,P=0.5mm,卧贴; JLCPCB Part Class: Extended Part; Datasheet: https://atta.szlcsc.com/upload/public/pdf/source/20190816/C413942_2A72D1AC756EAE17EEDF756A339D4500.pdf; Supplier: LCSC; Locking Feature: 翻盖式; Contact Type: 下接; Number of Contacts: 26P; Pitch: 0.5mm; Mounting Type: 卧贴; FFC, FCB Thickness: 0.3mm; Height Above Board: 2mm
FPC5 = FPC-05F-14PH15: 锁定特性:翻盖式;触点类型:下接;触点数量:14P;间距:0.5mm;安装类型:卧贴;工作温度范围:-25℃~+85℃;; LCSC Part Name: 间距:0.5mm P数:14P 翻盖式 下接; Supplier Part: C2856818; Manufacturer: XUNPU(讯普); Supplier Footprint: SMD,P=0.5mm,卧贴; JLCPCB Part Class: 扩展库; Datasheet: https://atta.szlcsc.com/upload/public/pdf/source/20210922/C2856818_BF9A09706769A6AB1B749235C5052B10.pdf; Supplier: LCSC; Locking Feature: 翻盖式; Contact Type: 下接; Number of Contacts: 14P; Pitch: 0.5mm; Mounting Type: 卧贴; FFC, FCB Thickness: 0.3mm; Height Above Board: 1.5mm; Operating Temperature Range: -25℃~+85℃
H1 = PZ254V-11-03P: LCSC Part Name: 1x3P 间距:2.54mm 方针 直插; Supplier Part: C2937625; Manufacturer: XFCN(兴飞); Supplier Footprint: 插件,P=2.54mm; JLCPCB Part Class: 扩展库; Datasheet: https://atta.szlcsc.com/upload/public/pdf/source/20200309/C492402_8335C3D49C4E4C618838D59BB1D024C1.pdf; Supplier: LCSC; Pin Structure: 1x3P; Pitch: 2.54mm; Circluar Pins/Square Pins: 方针; Mounting Type: 直插; Number of Rows: 单排; Number of Pins: 3P; Current Rating: 3A; Voltage Rating (Max): 250V; Length of Mating Pin: 6mm; Insulation Height: 2.5mm; Length of End Connection Pin: 3mm; Operating Temperature: -40℃~+105℃; Color: 黑色
R49-R64 = 0105WHJ0103TDE: LCSC Part Name: 厚膜电阻 10kΩ 31.25mW ±5%; Supplier Part: C407787; Manufacturer: UNI-ROYAL(厚声); Supplier Footprint: 01005; JLCPCB Part Class: Extended Part; Datasheet: https://atta.szlcsc.com/upload/public/pdf/source/20200306/C422600_1E6D84923E4A46A82E41ADD87F860B5C.pdf; Supplier: LCSC; Type: 厚膜电阻; Tolerance: ±5%; Power(Watts): 31.25mW; Voltage-Supply(Max): 15V; Operating Temperature: -55℃~+125℃
R65 R66 = 0105WHF1801TDE: LCSC Part Name: 厚膜电阻 1.8kΩ 31.25mW ±1%; Supplier Part: C560335; Manufacturer: UNI-ROYAL(厚声); Supplier Footprint: 01005; JLCPCB Part Class: Extended Part; Datasheet: https://atta.szlcsc.com/upload/public/pdf/source/20200306/C422600_1E6D84923E4A46A82E41ADD87F860B5C.pdf; Supplier: LCSC; Type: 厚膜电阻; Tolerance: ±1%; Power(Watts): 31.25mW; Voltage-Supply(Max): 15V; Temperature Coefficient: ±250ppm/℃; Operating Temperature: -55℃~+125℃
U32 = TCA9548ARGER: LCSC Part Name: TCA9548A 低电压 8 通道 I2C 开关带复位功能; Supplier Part: C555456; Manufacturer: TI(德州仪器); Supplier Footprint: VQFN-24-EP(4x4); JLCPCB Part Class: 扩展库; Datasheet: https://www.ti.com/cn/lit/gpn/tca9548a; Supplier: LCSC
U33 = PCA9557PW,118: LCSC Part Name: 带复位的8位I2C总线和SMBus I/O端口; Supplier Part: C141380; Manufacturer: NXP(恩智浦); Supplier Footprint: TSSOP-16; JLCPCB Part Class: 扩展库; Datasheet: https://www.nxp.com/docs/en/data-sheet/PCA9557.pdf; Supplier: LCSC; Interface: I2C；SMBus; Number of I/O: 8; Interrupt Output: 无中断输出; Supply Voltage: 2.3V~5.5V; Clock Frequency: 400kHz; Operating Temperature: -40℃~+85℃
U34 = LP5912-1.8DRVR: LCSC Part Name: 具有反向电流保护功能的 500mA、低噪声、低 IQ、低压降稳压器; Supplier Part: C2876234; Manufacturer: TI(德州仪器); Supplier Footprint: WSON-6-EP(2x2); JLCPCB Part Class: 扩展库; Datasheet: https://www.ti.com/cn/lit/gpn/lp5912; Supplier: LCSC; Output Type: 固定; Maximum Input Voltage: 6.5V; Output Voltage: 1.8V; Output Current: 500mA; Dropout Voltage: 250mV@(500mA); standby current: 55uA; Operating Temperature: -40℃~+125℃@(Tj); Output Polarity: 正极; Number of Outputs: 1
C136 = GRM188R60J476ME15D: LCSC Part Name: 47uF ±20% 6.3V; Supplier Part: C140782; Manufacturer: muRata(村田); Supplier Footprint: 0603; JLCPCB Part Class: Extended Part; Datasheet: https://atta.szlcsc.com/upload/public/pdf/source/20171113/C140782_15105612981581115778.pdf; Supplier: LCSC; Tolerance: ±20%; Voltage Rated: 6.3V; Temperature Coefficient: X5R
C362 = CC0100JRNPO6BN150: LCSC Part Name: 15pF ±5% 10V; Supplier Part: C513722; Manufacturer: YAGEO(国巨); Supplier Footprint: 01005; JLCPCB Part Class: Extended Part; Datasheet: https://atta.szlcsc.com/upload/public/pdf/source/20200415/C513722_1A62C6C1B30C92176A2267B37CF1303B.pdf; Supplier: LCSC; Tolerance: ±5%; Voltage Rated: 10V; Temperature Coefficient: NP0
C363 C364 = GJM0335C1E1R0WB01D: LCSC Part Name: ±0.05pF 1pF 25V; Supplier Part: C185624; Manufacturer: muRata(村田); Supplier Footprint: 0201; JLCPCB Part Class: Extended Part; Datasheet: https://atta.szlcsc.com/upload/public/pdf/source/20180612/C185624_7BF36E384A28A565E4692AE01D1CC423.pdf; Supplier: LCSC; Voltage Rating: 25V; Temperature Coefficient: C0G
CARD1 = SMN-303: LCSC Part Name: 自弹式 NanoSIM卡 卡座; Supplier Part: C266888; Manufacturer: XUNPU(讯普); Supplier Footprint: SMD; JLCPCB Part Class: 扩展库; Datasheet: https://atta.szlcsc.com/upload/public/pdf/source/20230608/69FA23A73293DEADC31E393DD83871F4.pdf; Supplier: LCSC; Card Connection Mode: 自弹式; Card Type: NanoSIM卡; Connector Type: 卡座; Card Detection: 有插卡检测; Body Height (Max): 1.37mm; Operating Temperature Range: -40℃~+85℃
OSC1 = OK2EL89CJI-111YLC-32.768K: LCSC Part Name: YSO120TK 32.768KHZ 4P 3225 1.8V-3.3V -40~85℃ CMOS; Supplier Part: C5280579; Manufacturer: YXC(扬兴晶振); Supplier Footprint: SMD3225-4P; JLCPCB Part Class: 扩展库; Datasheet: https://atta.szlcsc.com/upload/public/pdf/source/20250522/89C2EF4F2C4D1F8F758C9FC7AB87799E.pdf; Supplier: LCSC; Normal temperature Frequency Tolerance: ±10ppm; Output Type: CMOS; Voltage - Supply: 1.8V~3.3V; Frequency Stability: ±20ppm; Operating Temperature: -40℃~+85℃
Q2 = MMBT5551-E: LCSC Part Name: NPN 电流:600mA 耐压:160V; Supplier Part: C41371418; Manufacturer: MDD(辰达半导体); Supplier Footprint: SOT-23; JLCPCB Part Class: 扩展库; Datasheet: https://atta.szlcsc.com/upload/public/pdf/source/20241113/0C9B68AE5C245EBCD1861CC91D852F33.pdf; Supplier: LCSC; Transistor Type: NPN; Collector Current (Ic): 600mA; Collector-Emitter Breakdown Voltage (Vceo): 160V; Power Dissipation (Pd): 300mW; DC Current Gain (hFE@Ic,Vce): 80@1mA,5V; Transition Frequency (fT): 100MHz; Collector Cut-Off Current (Icbo): 50nA; Collector-Emitter Saturation Voltage (VCE(sat)@Ic,Ib): 150mV@10mA,1mA; Operating Temperature: -55℃~+150℃
R20 = 0201WMF3012TEE: LCSC Part Name: 30.1kΩ ±1% 50mW 厚膜电阻; Supplier Part: C778420; Manufacturer: UNI-ROYAL(厚声); Supplier Footprint: 0201; JLCPCB Part Class: Extended Part; Datasheet: https://atta.szlcsc.com/upload/public/pdf/source/20200306/C422600_1E6D84923E4A46A82E41ADD87F860B5C.pdf; Supplier: LCSC; Type: 厚膜电阻; Tolerance: ±1%; Power(Watts): 50mW; Overload Voltage (Max): 25V; Temperature Coefficient: ±200ppm/℃; Operating Temperature Range: -55℃~+155℃
R21 = RC0201FR-07200KL: LCSC Part Name: 厚膜电阻 200kΩ ±1% 50mW; Supplier Part: C138163; Manufacturer: YAGEO(国巨); Supplier Footprint: 0201; JLCPCB Part Class: Extended Part; Datasheet: https://atta.szlcsc.com/upload/public/pdf/source/20181009/C309620_DA5935B6E1D48212CB7A533FE518B3C2.pdf; Supplier: LCSC; Type: 厚膜电阻; Tolerance: ±1%; Power(Watts): 50mW; Overload Voltage (Max): 25V; Temperature Coefficient: ±200ppm/℃; Operating Temperature Range: -55℃~+125℃
R22 R23 = RC0201FR-0722RL: LCSC Part Name: 厚膜电阻 22Ω ±1% 50mW; Supplier Part: C155743; Manufacturer: YAGEO(国巨); Supplier Footprint: 0201; JLCPCB Part Class: Extended Part; Datasheet: https://atta.szlcsc.com/upload/public/pdf/source/20181009/C309620_DA5935B6E1D48212CB7A533FE518B3C2.pdf; Supplier: LCSC; Type: 厚膜电阻; Tolerance: ±1%; Power(Watts): 50mW; Overload Voltage (Max): 25V; Temperature Coefficient: ±200ppm/℃; Operating Temperature Range: -55℃~+125℃
R24 R25 = 0201WMF1002TEE: LCSC Part Name: 10kΩ ±1% 50mW 厚膜电阻; Supplier Part: C473048; Manufacturer: UNI-ROYAL(厚声); Supplier Footprint: 0201; JLCPCB Part Class: Extended Part; Datasheet: https://atta.szlcsc.com/upload/public/pdf/source/20200306/C422600_1E6D84923E4A46A82E41ADD87F860B5C.pdf; Supplier: LCSC; Type: 厚膜电阻; Tolerance: ±1%; Power(Watts): 50mW; Overload Voltage (Max): 25V; Temperature Coefficient: ±200ppm/℃; Operating Temperature Range: -55℃~+155℃
RF1-RF3 RF5 RF6 = BWIPX-1-001E: LCSC Part Name: IPEX 内针; Supplier Part: C496552; Manufacturer: BAT WIRELESS(蝙蝠无线); Supplier Footprint: SMD; JLCPCB Part Class: 扩展库; Datasheet: https://atta.szlcsc.com/upload/public/pdf/source/20201223/C496552_05E5A9956EAE1A8819C5051D085B1DED.pdf; Supplier: LCSC; Connector Type: 板端; Interface Type: 内针; Number of Ports: 1; Frequency-Max: 6GHz; RF Series: IPEX; Impedance: 50Ω
TP20-TP23 = Test-Point: Check: false
U17 = SIM7600E: Supplier Part: C2995536; Manufacturer: SIMCOM(芯讯通无线科技); Supplier Footprint: SMD-87P; JLCPCB Part Class: Extended Part; Datasheet: https://atta.szlcsc.com/upload/public/pdf/source/20220413/3CC143B901FC3A012881AA581320EAD2.pdf; Supplier: LCSC
U19 = TPS7A7002DDAR: LCSC Part Name: 具有使能功能的 3A、低输入电压 (1.4V)、可调节超低压降稳压器; Supplier Part: C140311; Manufacturer: TI(德州仪器); Supplier Footprint: SOIC-8-EP; JLCPCB Part Class: 扩展库; Datasheet: https://www.ti.com/cn/lit/gpn/tps7a7002; Supplier: LCSC; Output Type: 可调; Maximum Input Voltage: 6.5V; Output Voltage: 500mV~5V; Output Current: 3A; Dropout Voltage: 600mV@(3A); standby current: 3mA; Feature: 防静电保护；低ESR；热保护(TSD)；欠压闭锁；过流保护(OCP)；带使能; Operating Temperature: -40℃~+125℃; Output Polarity: 正极; Number of Outputs: 1
U26 = ESDA6V1W5: LCSC Part Name: 单向ESD; Supplier Part: C48677; Manufacturer: ST(意法半导体); Supplier Footprint: SOT-323-5; JLCPCB Part Class: Extended Part; Datasheet: https://atta.szlcsc.com/upload/public/pdf/source/20150504/1457707285209.pdf; Supplier: LCSC; polarity: 单向; Reverse Stand-Off Voltage (Vrwm): 3V; Maximum Clamping Voltage: 6.1V; Peak Pulse Power Dissipation (Ppp): 150W; Breakdown Voltage: 6.1V; Number of Lines: 四路; Operating Temperature: -40℃~+125℃@(Tj); Type: ESD
U35 = WL1835MODGBMOCT: Supplier Part: C2654702; Manufacturer: TI(德州仪器); Supplier Footprint: QFM-100; JLCPCB Part Class: 扩展库; Datasheet: https://www.ti.com/cn/lit/gpn/wl1805mod; Supplier: LCSC; Support Interface: SDIO；UART; Output Power: 17.3dBm

## Nets
+5V: C135.2 C327.2 C328.2 C329.2 C330.2 C331.1 C379.1 D10.2(A) FPC1.7 FPC1.8 FPC1.9 FPC1.10 FPC2.7 FPC2.8 FPC2.9 FPC2.10 FPC3.7 FPC3.8 FPC3.9 FPC3.10 FPC4.7 FPC4.8 FPC4.9 FPC4.10 FPC5.12 FPC5.13 R82.2 R83.2 U19.2(EN) U19.3(IN) U32.21(VCC) U33.16(VDD) U34.4(EN) U34.6(IN) U36.2(+) U37.5(EN) U37.8(VCCB) U38.1(G) USB4.1(VBUS) USB4.5(VBUS) ; also on sheet 3 4
GND: BUZZER1.3 BUZZER1.4 BUZZER3.3 BUZZER3.4 BUZZER4.3 BUZZER4.4 C15.1 C16.1 C17.1 C18.1 C19.1 C20.1 C21.1 C22.1 C23.1 C24.1 C99.1 C100.1 C101.1 C102.1 C103.1 C104.1 C105.1 C106.1 C107.1 C108.1 C109.1 C110.1 C111.1 C112.1 C113.1 C114.1 C115.1 C116.1 C117.1 C118.1 C119.1 C120.1 C121.1 C122.1 C123.1 C124.1 C125.1 C126.1 C127.1 C128.1 C129.1 C130.1 C131.1 C132.1 C133.1 C134.1 C135.1 C136.1 C137.2 C141.1 C142.1 C143.1 C144.1 C145.1 C146.1 C147.1 C148.1 C149.1 C150.1 C151.1 C152.1 C153.1 C154.1 C155.1 C156.1 C157.1 C158.1 C159.1 C160.1 C162.1 C163.1 C164.1 C165.1 C166.1 C167.2 C168.2 C169.1 C170.1 C171.1 C172.1 C173.1 C174.1 C175.1 C176.1 C177.1 C178.1 C179.1 C180.1 C181.1 C182.1 C183.1 C184.1 C185.1 C186.1 C187.1 C188.1 C189.1 C190.1 C194.1 C195.1 C196.1 C197.1 C198.1 C199.1 C327.1 C328.1 C329.1 C330.1 C331.2 C332.1 C333.1 C334.1 C335.1 C336.1 C337.1 C338.1 C339.1 C340.1 C343.1 C344.1 C345.1 C349.1 C350.1 C351.1 C352.1 C353.1 C354.1 C355.1 C356.1 C357.1 C358.1 C359.1 C360.2 C361.2 C362.1 C365.1 C366.1 C367.1 C368.1 C369.1 C378.1 C379.2 C381.1 C382.1 C383.1 C384.1 C385.1 C386.1 C387.1 CARD1.C5(GND) D7.3(GND) D7.8(GND) D8.3(GND) D8.8(GND) D9.3(GND) D9.8(GND) D11.2(A) D12.2(A) FPC1.3 FPC1.6 FPC1.11 FPC1.14 FPC1.17 FPC1.20 FPC1.23 FPC1.26 FPC1.27 FPC1.28 FPC2.3 FPC2.6 FPC2.11 FPC2.14 FPC2.17 FPC2.20 FPC2.23 FPC2.26 FPC2.27 FPC2.28 FPC3.3 FPC3.6 FPC3.11 FPC3.14 FPC3.17 FPC3.20 FPC3.23 FPC3.26 FPC3.27 FPC3.28 FPC4.3 FPC4.6 FPC4.11 FPC4.14 FPC4.17 FPC4.20 FPC4.23 FPC4.26 FPC4.27 FPC4.28 FPC5.1 FPC5.6 FPC5.11 FPC5.14 FPC5.15 FPC5.16 H1.2 OSC1.2(GND) Q2.2(E) Q3.2(E) Q5.2(E) Q6.2(E) Q7.2(S) Q8.2(S) Q9.2(S) Q10.2(S) R20.2 R77.1 R87.1 R88.1 RF1.2(GND) RF1.3(GND) RF2.2(GND) RF2.3(GND) RF3.2(GND) RF3.3(GND) RF5.2(GND) RF5.3(GND) RF6.2(GND) RF6.3(GND) U17.1(GND) U17.2(GND) U17.5(GND) U17.10(GND) U17.14(GND) U17.37(GND) U17.40(GND) U17.41(GND) U17.43(GND) U17.57(GND) U17.58(GND) U17.60(GND) U17.61(GND) U17.64(GND) U17.65(GND) U17.77(GND) U17.78(GND) U17.80(GND) U17.81(GND) U19.8(GND) U19.9(EP) U26.2 U32.9(GND) U32.18(A2) U32.22(A0) U32.23(A1) U33.3(A0) U33.4(A1) U33.5(A2) U33.8(VSS) U34.5(GND) U34.7(EP) U35.1(GND) U35.7(GND) U35.9(GND) U35.15(GND) U35.16(GND) U35.17(GND) U35.19(GND) U35.20(GND) U35.23(GND) U35.24(GND) U35.28(GND) U35.29(GND) U35.30(GND) U35.31(GND) U35.33(GND) U35.34(GND) U35.35(GND) U35.37(GND) U35.39(GND) U35.44(GND) U35.45(GND) U35.48(GND) U35.49(GND) U35.54(GND) U35.55(GND) U35.59(GND) U35.61(GND) U35.63(GND) U35.G1(GND) U35.G2(GND) U35.G3(GND) U35.G4(GND) U35.G5(GND) U35.G6(GND) U35.G7(GND) U35.G8(GND) U35.G9(GND) U35.G10(GND) U35.G11(GND) U35.G12(GND) U35.G13(GND) U35.G14(GND) U35.G15(GND) U35.G16(GND) U35.G17(GND) U35.G18(GND) U35.G19(GND) U35.G20(GND) U35.G21(GND) U35.G22(GND) U35.G23(GND) U35.G24(GND) U35.G25(GND) U35.G26(GND) U35.G27(GND) U35.G28(GND) U35.G29(GND) U35.G30(GND) U35.G31(GND) U35.G32(GND) U35.G33(GND) U35.G34(GND) U35.G35(GND) U35.G36(GND) U36.1(-) U37.4(GND) U39.2(S) U40.2(S) USB1.2(TMDS Data 2 Shield) USB1.5(TMDS Data 1 Shield) USB1.8(TMDS Data 0 Shield) USB1.11(TMDS Clock Shield) USB1.17(DDC/CEC Ground) USB1.20(GND) USB1.21(GND) USB1.22(GND) USB1.23(GND) USB3.A1(GND) USB3.A12(GND) USB3.B1(GND) USB3.B12(GND) USB4.4(GND) USB4.8(GND) USB4.9(GND) USB4.10(GND) USB4.11(GND) USB4.12(GND) ; also on sheet 1 2 3 4
VCC_1.8V: C333.2 C387.2 R24.2 R25.2 ; also on sheet 1 2 4
VCC_1.8V_ALT: C194.2 C195.2 C334.2 C335.2 C336.2 C351.2 C352.2 C368.2 C369.2 C384.2 C385.2 C386.2 R78.2 R79.2 ; also on sheet 1 4
VCC_3.3V: BUZZER1.1(+) BUZZER3.1(+) BUZZER4.1(+) D2.1(K) D5.1(K) D6.1(K) R65.2 R66.2 ; also on sheet 1 2 4
VCC_3.3V_S0: C378.2 R75.2 R80.2 R81.2 U37.1(VCCA)
VDD_0.6V: C169.2 C170.2 C171.2 C172.2 C173.2 C174.2 C175.2 C176.2 C177.2 C178.2 C179.2 C180.2 C198.2 C199.2 ; also on sheet 1 2 4
VDD_0.75V_S0: C337.2 C338.2 C343.2 C344.2 C345.2 C365.2 C366.2 C367.2 ; also on sheet 1 4
VDD_0.75V_S3: C339.2 C340.2 ; also on sheet 1 4
VDD_1.1V: C167.1 C168.1 ; also on sheet 1 2 4
VDD_1.2V: C349.2 C350.2 ; also on sheet 1 4
VDD_CPU_BIG0: C157.2 C158.2 C159.2 C160.2 C162.2 C163.2 C164.2 C165.2 C166.2 L20.1 ; also on sheet 1 4
VDD_CPU_BIG0_MEM: C155.2 C156.2 L20.2 ; also on sheet 1
VDD_CPU_BIG1: C145.2 C146.2 C147.2 C148.2 C149.2 C150.2 C151.2 C152.2 C153.2 C154.2 L19.1 ; also on sheet 1 4
VDD_CPU_BIG1_MEM: C143.2 C144.2 L19.2 ; also on sheet 1
VDD_CPU_LIT: C99.2 C100.2 C101.2 C102.2 C103.2 C104.2 C105.2 L16.1 ; also on sheet 1 4
VDD_CPU_LIT_MEM: C106.2 C107.2 L16.2 ; also on sheet 1
VDD_DDR: C181.2 C182.2 C183.2 C184.2 C185.2 C186.2 C187.2 C188.2 C189.2 C190.2 ; also on sheet 1 4
VDD_DDR_PLL: C196.2 C197.2 ; also on sheet 1 4
VDD_GPU: C15.2 C16.2 C17.2 C19.2 C20.2 C21.2 C22.2 C23.2 C24.2 L15.1 ; also on sheet 1 4
VDD_GPU_MEM: C18.2 L15.2 ; also on sheet 1
VDD_LOGIC: C108.2 C109.2 C110.2 C111.2 C112.2 C113.2 C114.2 C115.2 C116.2 ; also on sheet 1 4
VDD_NPU: C125.2 C126.2 C127.2 C128.2 C129.2 C130.2 C131.2 C132.2 L18.1 ; also on sheet 1 4
VDD_NPU_MEM: C133.2 C134.2 L18.2 ; also on sheet 1
VDD_VDENC: C117.2 C118.2 C119.2 C120.2 C121.2 C122.2 C123.2 L17.1 ; also on sheet 1 4
VDD_VDENC_MEM: C124.2 L17.2 ; also on sheet 1
BT_CTS: U35.51(BT_HCI_CTS_1V8) ; also on sheet 1
BT_EN: U35.41(BT_EN)
BT_PLL_RX: U35.53(BT_HCI_RX_1V8) ; also on sheet 1
BT_PLL_TX: U35.52(BT_HCI_TX_1V8) ; also on sheet 1
BT_RTS: U35.50(BT_HCI_RTS_1V8) ; also on sheet 1
BUZZER1_PWM: R28.1
BUZZER2_PWM: R42.1
BUZZER3_PWM: R43.1
CAM1_CLKN: FPC1.18 ; also on sheet 1
CAM1_CLKP: FPC1.19 ; also on sheet 1
CAM1_D1N: FPC1.15 ; also on sheet 1
CAM1_D1P: FPC1.16 ; also on sheet 1
CAM1_D2N: FPC1.21 ; also on sheet 1
CAM1_D2P: FPC1.22 ; also on sheet 1
CAM1_D3N: FPC1.12 ; also on sheet 1
CAM1_D3P: FPC1.13 ; also on sheet 1
CAM1_D4N: FPC1.24 ; also on sheet 1
CAM1_D4P: FPC1.25 ; also on sheet 1
CAM1_PWRON: FPC1.1 R58.1 U33.7(IO1)
CAM1_SCL: FPC1.5 R49.1 U32.1(SD0)
CAM1_SDA: FPC1.4 R50.2 U32.2(SC0)
CAM1_XCLR: FPC1.2 R57.1 U33.6(IO0)
CAM2_CLKN: FPC2.18 ; also on sheet 1
CAM2_CLKP: FPC2.19 ; also on sheet 1
CAM2_D1N: FPC2.15 ; also on sheet 1
CAM2_D1P: FPC2.16 ; also on sheet 1
CAM2_D2N: FPC2.21 ; also on sheet 1
CAM2_D2P: FPC2.22 ; also on sheet 1
CAM2_D3N: FPC2.12 ; also on sheet 1
CAM2_D3P: FPC2.13 ; also on sheet 1
CAM2_D4N: FPC2.24 ; also on sheet 1
CAM2_D4P: FPC2.25 ; also on sheet 1
CAM2_PWRON: FPC2.1 R60.1 U33.10(IO3)
CAM2_SCL: FPC2.5 R51.1 U32.3(SD1)
CAM2_SDA: FPC2.4 R52.1 U32.4(SC1)
CAM2_XCLR: FPC2.2 R59.1 U33.9(IO2)
CAM3_CLKN: FPC3.18 ; also on sheet 1
CAM3_CLKP: FPC3.19 ; also on sheet 1
CAM3_D1N: FPC3.15 ; also on sheet 1
CAM3_D1P: FPC3.16 ; also on sheet 1
CAM3_D2N: FPC3.21 ; also on sheet 1
CAM3_D2P: FPC3.22 ; also on sheet 1
CAM3_D3N: FPC3.12 ; also on sheet 1
CAM3_D3P: FPC3.13 ; also on sheet 1
CAM3_D4N: FPC3.24 ; also on sheet 1
CAM3_D4P: FPC3.25 ; also on sheet 1
CAM3_PWRON: FPC3.1 R63.1 U33.12(IO5)
CAM3_SCL: FPC3.5 R53.1 U32.5(SD2)
CAM3_SDA: FPC3.4 R54.2 U32.6(SC2)
CAM3_XCLR: FPC3.2 R61.1 U33.11(IO4)
CAM4_CLKN: FPC4.18 ; also on sheet 1
CAM4_CLKP: FPC4.19 ; also on sheet 1
CAM4_D1N: FPC4.15 ; also on sheet 1
CAM4_D1P: FPC4.16 ; also on sheet 1
CAM4_D2N: FPC4.21 ; also on sheet 1
CAM4_D2P: FPC4.22 ; also on sheet 1
CAM4_D3N: FPC4.12 ; also on sheet 1
CAM4_D3P: FPC4.13 ; also on sheet 1
CAM4_D4N: FPC4.24 ; also on sheet 1
CAM4_D4P: FPC4.25 ; also on sheet 1
CAM4_PWRON: FPC4.1 R62.1 U33.14(IO7)
CAM4_SCL: FPC4.5 R55.2 U32.7(SD3)
CAM4_SDA: FPC4.4 R56.2 U32.8(SC3)
CAM4_XCLR: FPC4.2 R64.1 U33.13(IO6)
GYRO_SPI_CLK: FPC5.3
GYRO_SPI_CS: FPC5.2
GYRO_SPI_MISO: FPC5.5
GYRO_SPI_MOSI: FPC5.4
HDMI_0.85V: C381.2 C382.2 C383.2 ; also on sheet 1 4
HDMI_CEC: D9.10(IO1_S) U38.3(D)
HDMI_CEC_PORT: D9.1(IO1_C) USB1.13(CEC)
HDMI_CEC_SOC: R75.1 U38.2(S) ; also on sheet 1
HDMI_D0N_SOC: C377.2 ; also on sheet 1
HDMI_D0N_TX: D8.2(IO2_C) R74.1 USB1.9(TMDS Data 0-)
HDMI_D0N_TX_SOC: C377.1 D8.9(IO2_S)
HDMI_D0P_SOC: C376.2 ; also on sheet 1
HDMI_D0P_TX: D8.1(IO1_C) R73.1 USB1.7(TMDS Data 0+)
HDMI_D0P_TX_SOC: C376.1 D8.10(IO1_S)
HDMI_D1N_SOC: C372.2 ; also on sheet 1
HDMI_D1N_TX: D8.4(IO3_C) R69.1 USB1.6(TMDS Data 1-)
HDMI_D1N_TX_SOC: C372.1 D8.7(IO3_S)
HDMI_D1P_SOC: C373.2 ; also on sheet 1
HDMI_D1P_TX: D8.5(IO4_C) R70.1 USB1.4(TMDS Data 1+)
HDMI_D1P_TX_SOC: C373.1 D8.6(IO4_S)
HDMI_D2N_SOC: C375.2 ; also on sheet 1
HDMI_D2N_TX: D7.2(IO2_C) R72.1 USB1.3(TMDS Data 2-)
HDMI_D2N_TX_SOC: C375.1 D7.9(IO2_S)
HDMI_D2P_SOC: C374.2 ; also on sheet 1
HDMI_D2P_TX: D7.1(IO1_C) R71.1 USB1.1(TMDS Data 2+)
HDMI_D2P_TX_SOC: C374.1 D7.10(IO1_S)
HDMI_D3N_SOC: C370.2 ; also on sheet 1
HDMI_D3N_TX: D7.4(IO3_C) R67.1 USB1.12(TMDS Clock-)
HDMI_D3N_TX_SOC: C370.1 D7.7(IO3_S)
HDMI_D3P_SOC: C371.2 ; also on sheet 1
HDMI_D3P_TX: D7.5(IO4_C) R68.1 USB1.10(TMDS Clock+)
HDMI_D3P_TX_SOC: C371.1 D7.6(IO4_S)
HDMI_HPD: D9.6(IO4_S) R76.1
HDMI_HPD_PORT: D9.5(IO4_C) USB1.19(Hot Plug Detect)
HDMI_HPD_SOC: R79.1 U39.3(D) ; also on sheet 1
HDMI_SCL: R80.1 U37.2(SCLA) ; also on sheet 1
HDMI_SCL_5V: D9.9(IO2_S) R83.1 U37.7(SCLB)
HDMI_SCL_PORT: D9.2(IO2_C) USB1.15(SCL)
HDMI_SDA: R81.1 U37.3(SDAA) ; also on sheet 1
HDMI_SDA_5V: D9.7(IO3_S) R82.1 U37.6(SDAB)
HDMI_SDA_PORT: D9.4(IO3_C) USB1.16(SDA)
HDMI_TX_ON: Q7.1(G) Q8.1(G) Q9.1(G) Q10.1(G)
I2C_IOMUX_RESET: U33.15(RESET#)
I2C_MUX1_RESET: U32.24(RESET#)
LTE_PWRKEY: U17.3(PWRKEY)
LTE_RESET: U17.4(RESET)
LTE_STATUS: U17.49(STATUS)
LTE_USB_DN: U17.12(USB_DN)
LTE_USB_DP: U17.13(USB_DP)
LTE_USB_VBUS: U17.11(USB_VBUS)
PLL_1V8_I2C: C332.2 R49.2 R50.1 R51.2 R52.2 R53.2 R54.1 R55.1 R56.1 R57.2 R58.2 R59.2 R60.2 R61.2 R62.2 R63.2 R64.2 U34.1(OUT)
PLL_I2C_SCL: FPC5.8 R66.1 U32.19(SCL) U33.1(SCL)
PLL_I2C_SDA: FPC5.7 R65.1 U32.20(SDA) U33.2(SDA)
PLL_IOMUX_INT: FPC5.9
PLL_IOMUX_RESET: FPC5.10
SDIO_SDCLK: U35.8(WL_SDIO_CLK_1V8) ; also on sheet 1
SDIO_SDCMD: U35.6(WL_SDIO_CMD_1V8) ; also on sheet 1
SDIO_SDD0: U35.10(WL_SDIO_D0_1V8) ; also on sheet 1
SDIO_SDD1: U35.11(WL_SDIO_D1_1V8) ; also on sheet 1
SDIO_SDD2: U35.12(WL_SDIO_D2_1V8) ; also on sheet 1
SDIO_SDD3: U35.13(WL_SDIO_D3_1V8) ; also on sheet 1
SIM_RF_PWR: C136.2 C141.2 C142.2 R21.2 U17.38(VBAT) U17.39(VBAT) U17.62(VBAT) U17.63(VBAT) U19.6(OUT)
TYPEC0_DM: R86.1 USB3.A7(D-) USB3.B7(D-)
TYPEC0_DP: R85.1 USB3.A6(D+) USB3.B6(D+)
UART_DBG_RX: H1.1 ; also on sheet 1
UART_DBG_TX: H1.3 ; also on sheet 1
USB0_DM: D11.1(C) R86.2 ; also on sheet 1
USB0_DP: D12.1(C) R85.2 ; also on sheet 1
USB1_DM: USB4.2(D-) ; also on sheet 1
USB1_DP: USB4.3(D+) ; also on sheet 1
USB2_DM: USB4.6(D-) ; also on sheet 1
USB2_DP: USB4.7(D+) ; also on sheet 1
USIM_CD: CARD1.CD Q2.1(B) R24.1
USIM_CLK: R23.1 U17.19(USIM_CLK) U26.4
USIM_DATA: CARD1.C7(I/O) U17.17(USIM_DATA) U26.1
USIM_DET: Q2.3(C) R25.1 U17.53(USIM_DET)
USIM_RST: R22.1 U17.18(USIM_RST) U26.3
USIM_VDD: C137.1 CARD1.C1(VCC) U17.20(USIM_VDD) U26.5
WLAN_1.8V: C358.2 C359.2 C360.1 C361.1 OSC1.4(VDD) U35.38(VIO)
WLAN_3.3V: C353.2 C354.2 C355.2 C356.2 C357.2 U35.46(VBAT_IN) U35.47(VBAT_IN)
WLAN_CLK: C362.2 OSC1.3(OUT) U35.36(EXT_32K)
WLAN_EN: U35.40(WLAN_EN)
WLAN_IRQ: U35.14(WL_IRQ_1V8)
$6N1560: R20.1 R21.1 U19.7(FB)
$6N2431: CARD1.C2(RST) R22.2
$6N2483: CARD1.C3(CLK) R23.2
$6N19418: RF1.1(SIG) U17.59(AUX_ANT)
$6N19441: RF2.1(SIG) U17.79(GNSS_ANT)
$6N19471: RF3.1(SIG) U17.82(MAIN_ANT)
$6N30590: TP20.1 U35.43(BT_UART_DBG)
$6N30611: TP21.1 U35.42(WL_UART_DBG)
$6N30713: TP22.1 U35.27(GPIO1)
$6N30734: TP23.1 U35.26(GPIO2)
$6N30821: C363.2 U35.32(2G4_ANT1_WB)
$6N30824: C363.1 RF5.1(SIG)
$6N30877: C364.2 U35.18(2G4_ANT2_W)
$6N30881: C364.1 RF6.1(SIG)
$7N259: Q3.1(B) R28.2
$7N354: BUZZER1.2 D2.2(A) Q3.3(C)
$7N3306: BUZZER3.2 D5.2(A) Q5.3(C)
$7N3310: Q5.1(B) R42.2
$7N3522: Q6.1(B) R43.2
$7N3525: BUZZER4.2 D6.2(A) Q6.3(C)
$10N3014: D10.1(K) USB1.18(+5V Power)
$10N4340: Q10.3(D) R67.2 R68.2
$10N4356: Q9.3(D) R69.2 R70.2
$10N4370: Q8.3(D) R71.2 R72.2
$10N4386: Q7.3(D) R73.2 R74.2
$10N6183: R76.2 R77.2 U40.1(G)
$10N6411: R78.1 U39.1(G) U40.3(D)
$10N11735: R87.2 USB3.B5(CC2)
$10N11796: R88.2 USB3.A5(CC1)

Not connected (* = marked no-connect by the designer): CARD1 8(EP)* 9(EP)* 10(EP)* 11(EP)* C6(VPP)*; OSC1 1(Tri-state)*; U17 6(SPI_CLK)* 7(SPI_MISO)* 8(SPI_MOSI)* 9(SPI_CS)* 15(VDD_1V8)* 16(USB_ID)* 21(SD_CMD)* 22(SD_DATA0)* 23(SD_DATA1)* 24(SD_DATA2)* 25(SD_DATA3)* 26(SD_CLK)* 27(SDIO_DATA1)* 28(SDIO_DATA2)* 29(SDIO_CMD)* 30(SDIO_DATA0)* 31(SDIO_DATA3)* 32(SDIO_CLK)* 33(GPIO3)* 34(GPIO6)* 35(HSIC_STROBE)* 36(HSIC_DATA)* 42(NC)* 44(VDD_AUX)* 45(ISINK)* 46(ADC2)* 47(ADC1)* 48(SD_DET)* 50(GPIO43*)* 51(NETLIGHT)* 52(GPIO41)* 54(FLIGHTMODE)* 55(SCL)* 56(SDA)* 66(RTS)* 67(CTS)* 68(RXD)* 69(RI)* 70(DCD)* 71(TXD)* 72(DTR)* 73(PCM_OUT)* 74(PCM_IN)* 75(PCM_SYNC)* 76(PCM_CLK)* 83(COEX1*)* 84(COEX2)* 85(BOOT_CFG0*)* 86(COEX3*)* 87(GPIO77)*; U19 1(NC)* 4(NC)* 5(NC)*; U32 10(SD4) 11(SC4) 12(SD5) 13(SC5) 14(SD6) 15(SC6) 16(SD7) 17(SC7) 25(EP)*; U34 2(NC)* 3(PG)*; U35 2(GPIO11)* 3(GPIO9)* 4(GPIO10)* 5(GPIO12)* 21(RESERVED1)* 22(RESERVED2)* 25(GPIO4)* 56(BT_AUD_IN)* 57(BT_AUD_OUT)* 58(BT_AUD_FSYNC)* 60(BT_AUD_CLK)* 62(RESERVED3)* 64(RESERVED)*; USB1 14(Reserved (N.C.))*; USB3 3(EP)* 4(EP)* 25(EP)* A2(TX1+)* A3(TX1-)* A4(VBUS)* A8(SUB1)* A9(VBUS)* A10(RX2-)* A11(RX2+)* B2(TX2+)* B3(TX2-)* B4(VBUS)* B8(SUB2)* B9(VBUS)* B10(RX1-)* B11(RX1+)*

## Notes on the sheets
sheet 5
- DDR VDDQ CH1
- DDR VDD CH1
- DDR VDDQ CH0
- DDR VDD CH0
- DDR VDDQ CKE
- VDDQ_CK
- DDR PLL
- PMUIO
- HDMI TX PWR
- PLL_AVDD
- PLL_DVDD
- EMMCIO
- PMU
- MIPI PLL
- MIPI PLL
- MIPI PLL
- Below Package
- SoC Side Filitering
- Below Package
sheet 6
- Wireless Connectivity
sheet 7
- Audio
